# EAGLE design alarm_controller (EAGLE 7.6.0)

## Sheet 1 of 3
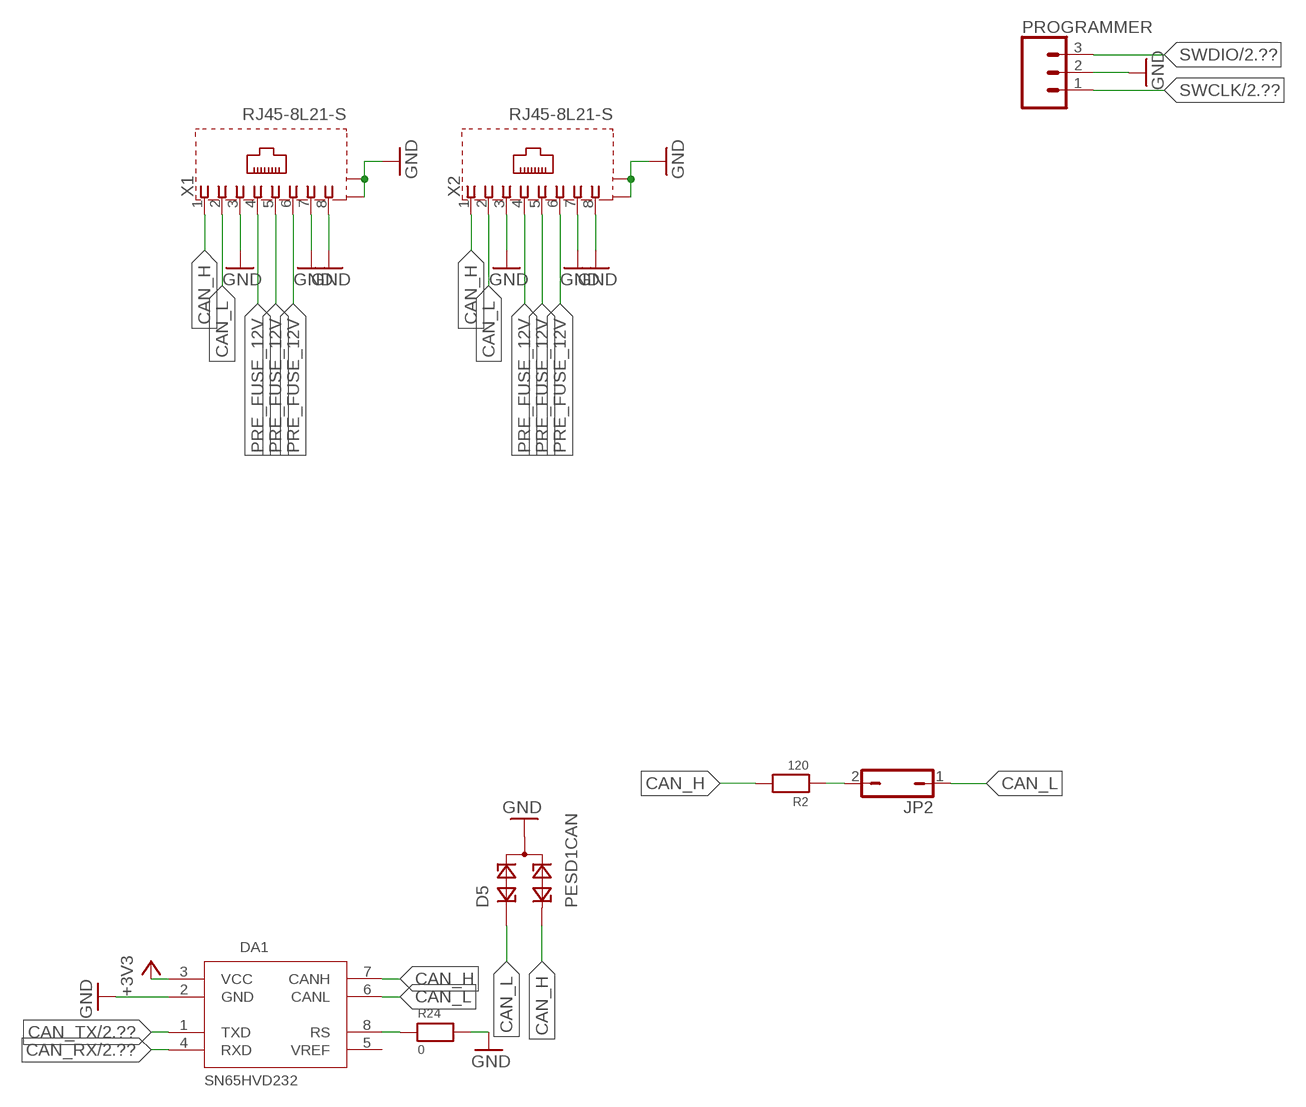
[diagram p0: schematic, sheet 1, part 1 of 2]
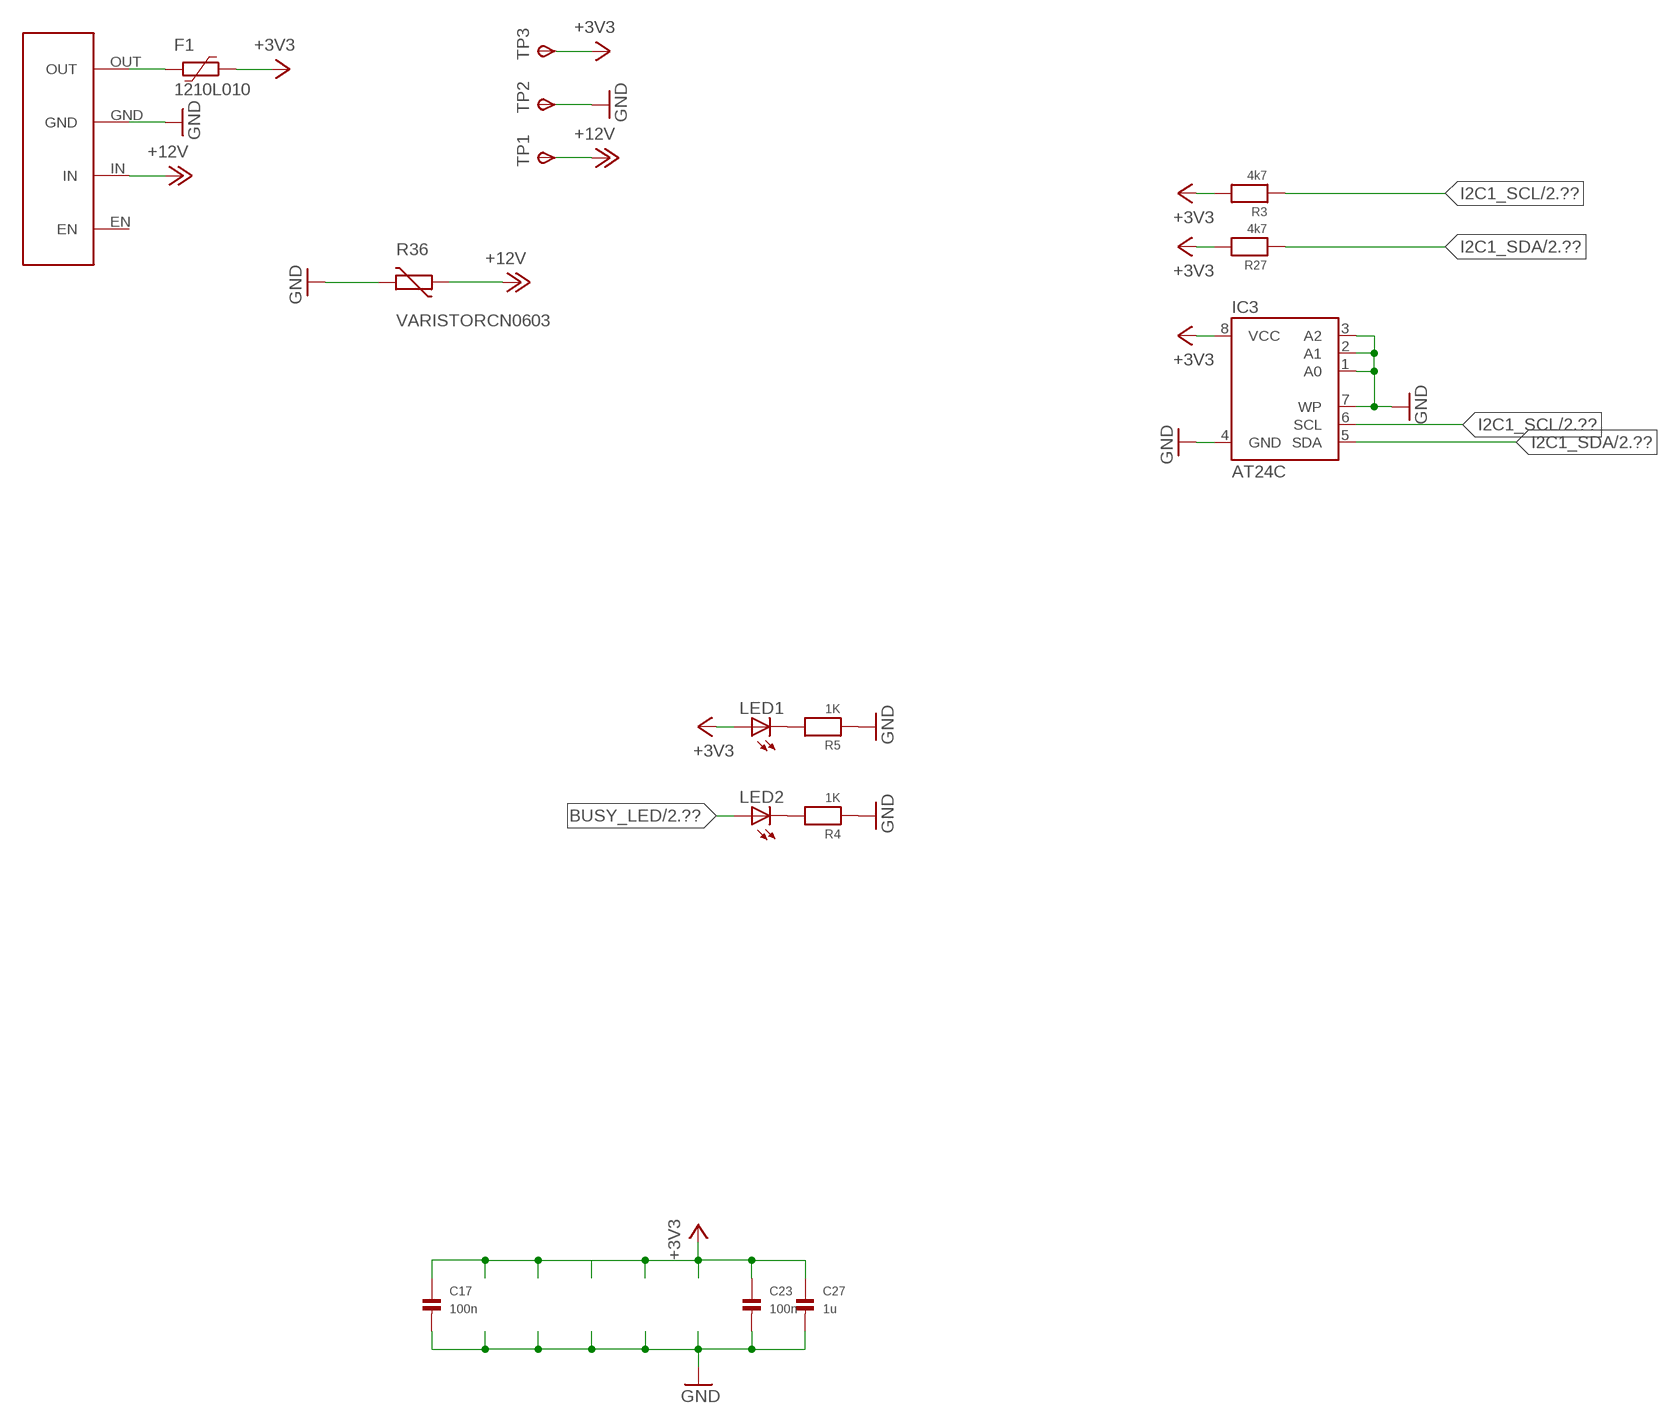
[diagram p1: schematic, sheet 1, part 2 of 2]

### Parts
C17  100n  CAP_CERAMIC0603  [0603]
C23  100n  CAP_CERAMIC0603  [0603]
C27  1u  CAP_CERAMIC0603  [0603]
D5  PESD1CAN  [SOT23]
DA1  SN65HVD232  [SO08]
F1  1210L010  [1210L]
IC3  AT24C  [SOIC8]
JP2  JP1Q  [JP1]
LED1  LEDCHIPLED_0805  [CHIPLED_0805]
LED2  LEDCHIPLED_0805  [CHIPLED_0805]
PROGRAMMER  CONN_03LOCK  [1X03_LOCK]
R2  120  RESISTOR0603  [0603]
R3  4k7  RESISTOR0603  [0603]
R4  1K  RESISTOR0603  [0603]
R5  1K  RESISTOR0603  [0603]
R24  0  RESISTOR0603  [0603]
R27  4k7  RESISTOR0603  [0603]
R36  VARISTORCN0603  [CT/CN0603]
TP1  TPSTP20R  [TP20R]
TP2  TPSTP20R  [TP20R]
TP3  TPSTP20R  [TP20R]
U$4  HW-613  [HW-613]
X1  RJ45-8L21-S  [RJ45-SHIELD1]
X2  RJ45-8L21-S  [RJ45-SHIELD1]

### Nets
+3V3: C17.1 C23.1 C27.1 DA1.3(VCC) F1.1 IC3.8(VCC) LED1.A R3.2 R27.2 TP3.TP(PP) ; also sheet 2,3
+12V: R36.1 TP1.TP(PP) U$4.IN ; also sheet 3
BUSY_LED: LED2.A ; also sheet 2
CAN_H: D5.2 DA1.7(CANH) R2.2 X1.1 X2.1
CAN_L: D5.1 DA1.6(CANL) JP2.1 X1.2 X2.2
CAN_RX: DA1.4(RXD) ; also sheet 2
CAN_TX: DA1.1(TXD) ; also sheet 2
GND: C17.2 C23.2 C27.2 D5.3 DA1.2(GND) IC3.1(A0) IC3.2(A1) IC3.3(A2) IC3.4(GND) IC3.7(WP) PROGRAMMER.2 R4.1 R5.1 R24.2 R36.2 TP2.TP(PP) U$4.GND X1.3 X1.7 X1.8 X1.S1(S) X1.S2(S) X2.3 X2.7 X2.8 X2.S1(S) X2.S2(S) ; also sheet 2,3
I2C1_SCL: IC3.6(SCL) R3.1 ; also sheet 2
I2C1_SDA: IC3.5(SDA) R27.1 ; also sheet 2
N$3: F1.2 U$4.OUT
N$6: LED1.C R5.2
N$8: LED2.C R4.2
N$12: JP2.2 R2.1
N$17: DA1.8(RS) R24.1
PRE_FUSE_12V: X1.4 X1.5 X1.6 X2.4 X2.5 X2.6 ; also sheet 3
SWCLK: PROGRAMMER.1 ; also sheet 2
SWDIO: PROGRAMMER.3 ; also sheet 2
Unconnected: DA1.5(VREF) U$4.EN

## Sheet 2 of 3
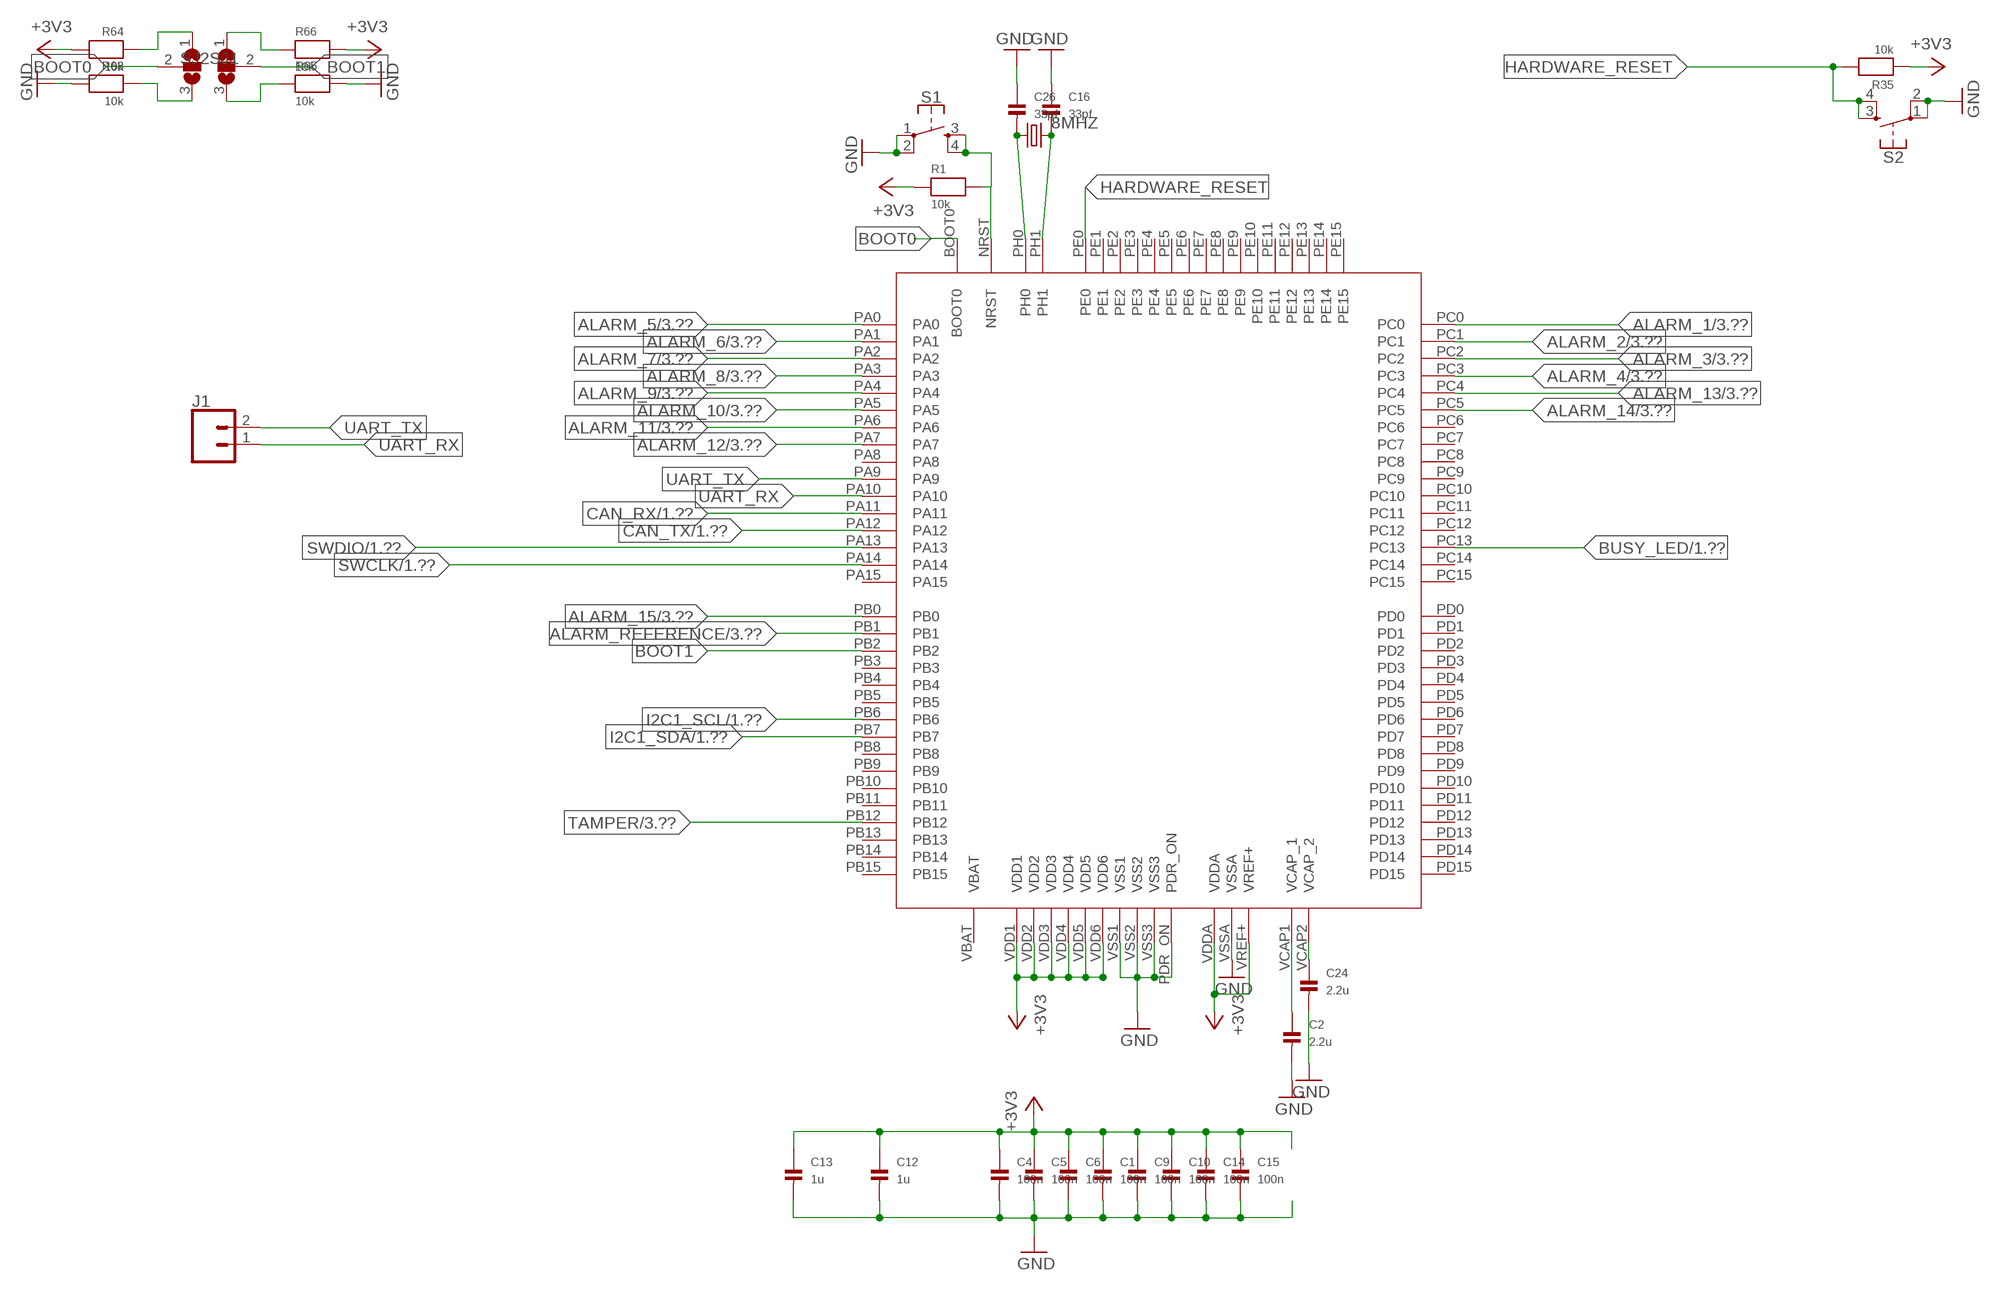
[diagram p2: schematic, sheet 2]

### Parts
8MHZ  CRYSTALHC49UP  [HC49UP]
C1  100n  CAP_CERAMIC0603  [0603]
C2  2.2u  CAP_CERAMIC0603  [0603]
C4  100n  CAP_CERAMIC0603  [0603]
C5  100n  CAP_CERAMIC0603  [0603]
C6  100n  CAP_CERAMIC0603  [0603]
C9  100n  CAP_CERAMIC0603  [0603]
C10  100n  CAP_CERAMIC0603  [0603]
C12  1u  CAP_CERAMIC0603  [0603]
C13  1u  CAP_CERAMIC0603  [0603]
C14  100n  CAP_CERAMIC0603  [0603]
C15  100n  CAP_CERAMIC0603  [0603]
C16  33pf  CAP_CERAMIC0603  [0603]
C24  2.2u  CAP_CERAMIC0603  [0603]
C26  33pf  CAP_CERAMIC0603  [0603]
J1  CONN_02  [1X02]
R1  10k  RESISTOR0603  [0603]
R35  10k  RESISTOR0603  [0603]
R63  10k  RESISTOR0603  [0603]
R64  10k  RESISTOR0603  [0603]
R65  10k  RESISTOR0603  [0603]
R66  10k  RESISTOR0603  [0603]
S1  MOMENTARY-SWITCH-SPST-2-SMD-4.6X2.8MM  [TACTILE_SWITCH_SMD_4.6X2.8MM]
S2  MOMENTARY-SWITCH-SPST-2-SMD-4.6X2.8MM  [TACTILE_SWITCH_SMD_4.6X2.8MM]
SJ1  SJ2W  [SJ_2]
SJ2  SJ2W  [SJ_2]
U$1  STM32F4V_100PIN_GENERIC  [LQFP100]

### Nets
+3V3: C1.1 C4.1 C5.1 C6.1 C9.1 C10.1 C12.1 C13.1 C14.1 C15.1 R1.1 R35.1 R64.2 R66.2 U$1.VDD1 U$1.VDD2 U$1.VDD3 U$1.VDD4 U$1.VDD5 U$1.VDD6 U$1.VDDA U$1.VREF+ ; also sheet 1,3
ALARM_1: U$1.PC0 ; also sheet 3
ALARM_2: U$1.PC1 ; also sheet 3
ALARM_3: U$1.PC2 ; also sheet 3
ALARM_4: U$1.PC3 ; also sheet 3
ALARM_5: U$1.PA0 ; also sheet 3
ALARM_6: U$1.PA1 ; also sheet 3
ALARM_7: U$1.PA2 ; also sheet 3
ALARM_8: U$1.PA3 ; also sheet 3
ALARM_9: U$1.PA4 ; also sheet 3
ALARM_10: U$1.PA5 ; also sheet 3
ALARM_11: U$1.PA6 ; also sheet 3
ALARM_12: U$1.PA7 ; also sheet 3
ALARM_13: U$1.PC4 ; also sheet 3
ALARM_14: U$1.PC5 ; also sheet 3
ALARM_15: U$1.PB0 ; also sheet 3
ALARM_REFERENCE: U$1.PB1 ; also sheet 3
BOOT0: SJ1.2 U$1.BOOT0
BOOT1: SJ2.2 U$1.PB2
BUSY_LED: U$1.PC13 ; also sheet 1
CAN_RX: U$1.PA11 ; also sheet 1
CAN_TX: U$1.PA12 ; also sheet 1
GND: C1.2 C2.2 C4.2 C5.2 C6.2 C9.2 C10.2 C12.2 C13.2 C14.2 C15.2 C16.1 C24.2 C26.1 R63.2 R65.2 S1.1 S1.2 S2.1 S2.2 U$1.PDR_ON U$1.VSS1 U$1.VSS2 U$1.VSS3 U$1.VSSA ; also sheet 1,3
HARDWARE_RESET: R35.2 S2.3 S2.4 U$1.PE0
I2C1_SCL: U$1.PB6 ; also sheet 1
I2C1_SDA: U$1.PB7 ; also sheet 1
N$1: 8MHZ.2 C16.2 U$1.PH1
N$2: 8MHZ.1 C26.2 U$1.PH0
N$4: C2.1 U$1.VCAP1(VCAP_1)
N$5: R66.1 SJ2.1
N$7: R1.2 S1.3 S1.4 U$1.NRST
N$9: C24.1 U$1.VCAP2(VCAP_2)
N$13: R64.1 SJ1.1
N$14: R65.1 SJ2.3
N$15: R63.1 SJ1.3
SWCLK: U$1.PA14 ; also sheet 1
SWDIO: U$1.PA13 ; also sheet 1
TAMPER: U$1.PB12 ; also sheet 3
UART_RX: J1.1 U$1.PA10
UART_TX: J1.2 U$1.PA9
Unconnected: U$1.PA8 U$1.PA15 U$1.PB3 U$1.PB4 U$1.PB5 U$1.PB8 U$1.PB9 U$1.PB10 U$1.PB11 U$1.PB13 U$1.PB14 U$1.PB15 U$1.PC6 U$1.PC7 U$1.PC8 U$1.PC9 U$1.PC10 U$1.PC11 U$1.PC12 U$1.PC14 U$1.PC15 U$1.PD0 U$1.PD1 U$1.PD2 U$1.PD3 U$1.PD4 U$1.PD5 U$1.PD6 U$1.PD7 U$1.PD8 U$1.PD9 U$1.PD10 U$1.PD11 U$1.PD12 U$1.PD13 U$1.PD14 U$1.PD15 U$1.PE1 U$1.PE2 U$1.PE3 U$1.PE4 U$1.PE5 U$1.PE6 U$1.PE7 U$1.PE8 U$1.PE9 U$1.PE10 U$1.PE11 U$1.PE12 U$1.PE13 U$1.PE14 U$1.PE15 U$1.VBAT

## Sheet 3 of 3
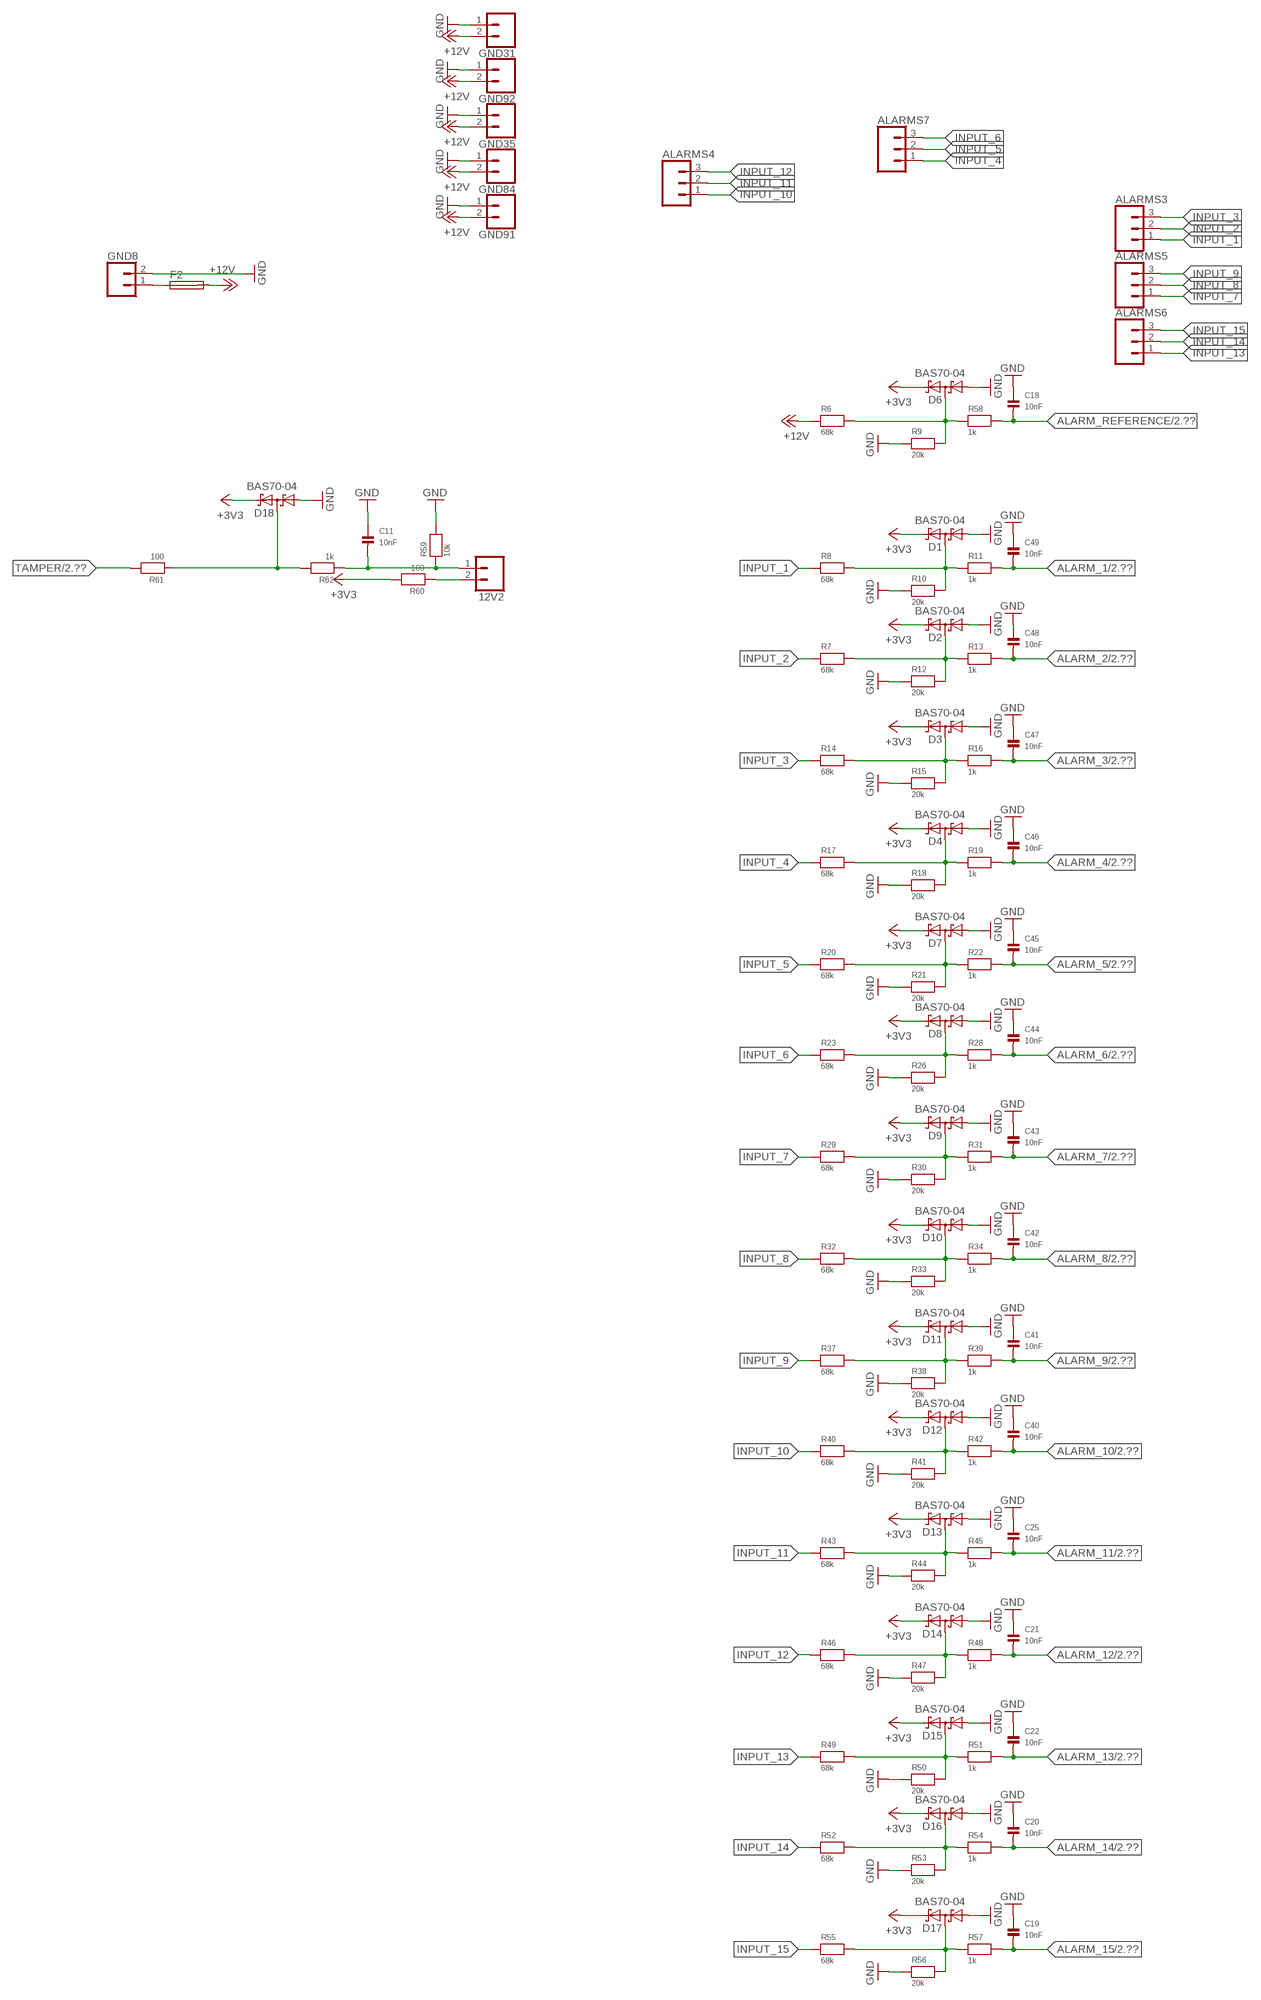
[diagram p3: schematic, sheet 3]

### Parts
12V2  CONN_023.5MM  [SCREWTERMINAL-3.5MM-2]
ALARMS3  CONN_03SCREW_LOCK  [SCREWTERMINAL-3.5MM-3_LOCK.007S]
ALARMS4  CONN_03SCREW_LOCK  [SCREWTERMINAL-3.5MM-3_LOCK.007S]
ALARMS5  CONN_03SCREW_LOCK  [SCREWTERMINAL-3.5MM-3_LOCK.007S]
ALARMS6  CONN_03SCREW_LOCK  [SCREWTERMINAL-3.5MM-3_LOCK.007S]
ALARMS7  CONN_03SCREW_LOCK  [SCREWTERMINAL-3.5MM-3_LOCK.007S]
C11  10nF  CAP_CERAMIC0603  [0603]
C18  10nF  CAP_CERAMIC0603  [0603]
C19  10nF  CAP_CERAMIC0603  [0603]
C20  10nF  CAP_CERAMIC0603  [0603]
C21  10nF  CAP_CERAMIC0603  [0603]
C22  10nF  CAP_CERAMIC0603  [0603]
C25  10nF  CAP_CERAMIC0603  [0603]
C40  10nF  CAP_CERAMIC0603  [0603]
C41  10nF  CAP_CERAMIC0603  [0603]
C42  10nF  CAP_CERAMIC0603  [0603]
C43  10nF  CAP_CERAMIC0603  [0603]
C44  10nF  CAP_CERAMIC0603  [0603]
C45  10nF  CAP_CERAMIC0603  [0603]
C46  10nF  CAP_CERAMIC0603  [0603]
C47  10nF  CAP_CERAMIC0603  [0603]
C48  10nF  CAP_CERAMIC0603  [0603]
C49  10nF  CAP_CERAMIC0603  [0603]
D1  BAS70-04  [SOT23]
D2  BAS70-04  [SOT23]
D3  BAS70-04  [SOT23]
D4  BAS70-04  [SOT23]
D6  BAS70-04  [SOT23]
D7  BAS70-04  [SOT23]
D8  BAS70-04  [SOT23]
D9  BAS70-04  [SOT23]
D10  BAS70-04  [SOT23]
D11  BAS70-04  [SOT23]
D12  BAS70-04  [SOT23]
D13  BAS70-04  [SOT23]
D14  BAS70-04  [SOT23]
D15  BAS70-04  [SOT23]
D16  BAS70-04  [SOT23]
D17  BAS70-04  [SOT23]
D18  BAS70-04  [SOT23]
F2  TE5  [TE5]
GND8  CONN_025MM  [SCREWTERMINAL-5MM-2]
GND31  CONN_023.5MM  [SCREWTERMINAL-3.5MM-2]
GND35  CONN_023.5MM  [SCREWTERMINAL-3.5MM-2]
GND84  CONN_023.5MM  [SCREWTERMINAL-3.5MM-2]
GND91  CONN_023.5MM  [SCREWTERMINAL-3.5MM-2]
GND92  CONN_023.5MM  [SCREWTERMINAL-3.5MM-2]
R6  68k  RESISTOR0603  [0603]
R7  68k  RESISTOR0603  [0603]
R8  68k  RESISTOR0603  [0603]
R9  20k  RESISTOR0603  [0603]
R10  20k  RESISTOR0603  [0603]
R11  1k  RESISTOR0603  [0603]
R12  20k  RESISTOR0603  [0603]
R13  1k  RESISTOR0603  [0603]
R14  68k  RESISTOR0603  [0603]
R15  20k  RESISTOR0603  [0603]
R16  1k  RESISTOR0603  [0603]
R17  68k  RESISTOR0603  [0603]
R18  20k  RESISTOR0603  [0603]
R19  1k  RESISTOR0603  [0603]
R20  68k  RESISTOR0603  [0603]
R21  20k  RESISTOR0603  [0603]
R22  1k  RESISTOR0603  [0603]
R23  68k  RESISTOR0603  [0603]
R26  20k  RESISTOR0603  [0603]
R28  1k  RESISTOR0603  [0603]
R29  68k  RESISTOR0603  [0603]
R30  20k  RESISTOR0603  [0603]
R31  1k  RESISTOR0603  [0603]
R32  68k  RESISTOR0603  [0603]
R33  20k  RESISTOR0603  [0603]
R34  1k  RESISTOR0603  [0603]
R37  68k  RESISTOR0603  [0603]
R38  20k  RESISTOR0603  [0603]
R39  1k  RESISTOR0603  [0603]
R40  68k  RESISTOR0603  [0603]
R41  20k  RESISTOR0603  [0603]
R42  1k  RESISTOR0603  [0603]
R43  68k  RESISTOR0603  [0603]
R44  20k  RESISTOR0603  [0603]
R45  1k  RESISTOR0603  [0603]
R46  68k  RESISTOR0603  [0603]
R47  20k  RESISTOR0603  [0603]
R48  1k  RESISTOR0603  [0603]
R49  68k  RESISTOR0603  [0603]
R50  20k  RESISTOR0603  [0603]
R51  1k  RESISTOR0603  [0603]
R52  68k  RESISTOR0603  [0603]
R53  20k  RESISTOR0603  [0603]
R54  1k  RESISTOR0603  [0603]
R55  68k  RESISTOR0603  [0603]
R56  20k  RESISTOR0603  [0603]
R57  1k  RESISTOR0603  [0603]
R58  1k  RESISTOR0603  [0603]
R59  10k  RESISTOR0603  [0603]
R60  100  RESISTOR0603  [0603]
R61  100  RESISTOR0603  [0603]
R62  1k  RESISTOR0603  [0603]

### Nets
12V_REFERENCE1: D2.3(C1A2) R7.2 R12.2 R13.1
12V_REFERENCE2: D3.3(C1A2) R14.2 R15.2 R16.1
12V_REFERENCE3: D4.3(C1A2) R17.2 R18.2 R19.1
12V_REFERENCE4: D7.3(C1A2) R20.2 R21.2 R22.1
12V_REFERENCE5: D8.3(C1A2) R23.2 R26.2 R28.1
12V_REFERENCE6: D9.3(C1A2) R29.2 R30.2 R31.1
12V_REFERENCE7: D10.3(C1A2) R32.2 R33.2 R34.1
12V_REFERENCE8: D11.3(C1A2) R37.2 R38.2 R39.1
12V_REFERENCE9: D12.3(C1A2) R40.2 R41.2 R42.1
12V_REFERENCE10: D13.3(C1A2) R43.2 R44.2 R45.1
12V_REFERENCE11: D14.3(C1A2) R46.2 R47.2 R48.1
12V_REFERENCE12: D15.3(C1A2) R49.2 R50.2 R51.1
12V_REFERENCE13: D16.3(C1A2) R52.2 R53.2 R54.1
12V_REFERENCE14: D17.3(C1A2) R55.2 R56.2 R57.1
+3V3: D1.2(C2) D2.2(C2) D3.2(C2) D4.2(C2) D6.2(C2) D7.2(C2) D8.2(C2) D9.2(C2) D10.2(C2) D11.2(C2) D12.2(C2) D13.2(C2) D14.2(C2) D15.2(C2) D16.2(C2) D17.2(C2) D18.2(C2) R60.2 ; also sheet 1,2
+12V: F2.2 GND31.2 GND35.2 GND84.2 GND91.2 GND92.2 R6.1 ; also sheet 1
A23: D6.3(C1A2) R6.2 R9.2 R58.1
ALARM_1: C49.2 R11.2 ; also sheet 2
ALARM_2: C48.2 R13.2 ; also sheet 2
ALARM_3: C47.2 R16.2 ; also sheet 2
ALARM_4: C46.2 R19.2 ; also sheet 2
ALARM_5: C45.2 R22.2 ; also sheet 2
ALARM_6: C44.2 R28.2 ; also sheet 2
ALARM_7: C43.2 R31.2 ; also sheet 2
ALARM_8: C42.2 R34.2 ; also sheet 2
ALARM_9: C41.2 R39.2 ; also sheet 2
ALARM_10: C40.2 R42.2 ; also sheet 2
ALARM_11: C25.2 R45.2 ; also sheet 2
ALARM_12: C21.2 R48.2 ; also sheet 2
ALARM_13: C22.2 R51.2 ; also sheet 2
ALARM_14: C20.2 R54.2 ; also sheet 2
ALARM_15: C19.2 R57.2 ; also sheet 2
ALARM_REFERENCE: C18.2 R58.2 ; also sheet 2
ASD: D1.3(C1A2) R8.2 R10.2 R11.1
ASDASD: D18.3(C1A2) R61.1 R62.2
GND: C11.1 C18.1 C19.1 C20.1 C21.1 C22.1 C25.1 C40.1 C41.1 C42.1 C43.1 C44.1 C45.1 C46.1 C47.1 C48.1 C49.1 D1.1(A1) D2.1(A1) D3.1(A1) D4.1(A1) D6.1(A1) D7.1(A1) D8.1(A1) D9.1(A1) D10.1(A1) D11.1(A1) D12.1(A1) D13.1(A1) D14.1(A1) D15.1(A1) D16.1(A1) D17.1(A1) D18.1(A1) GND8.2 GND31.1 GND35.1 GND84.1 GND91.1 GND92.1 R9.1 R10.1 R12.1 R15.1 R18.1 R21.1 R26.1 R30.1 R33.1 R38.1 R41.1 R44.1 R47.1 R50.1 R53.1 R56.1 R59.2 ; also sheet 1,2
INPUT_1: ALARMS3.1 R8.1
INPUT_2: ALARMS3.2 R7.1
INPUT_3: ALARMS3.3 R14.1
INPUT_4: ALARMS7.1 R17.1
INPUT_5: ALARMS7.2 R20.1
INPUT_6: ALARMS7.3 R23.1
INPUT_7: ALARMS5.1 R29.1
INPUT_8: ALARMS5.2 R32.1
INPUT_9: ALARMS5.3 R37.1
INPUT_10: ALARMS4.1 R40.1
INPUT_11: ALARMS4.2 R43.1
INPUT_12: ALARMS4.3 R46.1
INPUT_13: ALARMS6.1 R49.1
INPUT_14: ALARMS6.2 R52.1
INPUT_15: ALARMS6.3 R55.1
N$10: 12V2.2 R60.1
N$11: 12V2.1 C11.2 R59.1 R62.1
PRE_FUSE_12V: F2.1 GND8.1 ; also sheet 1
TAMPER: R61.2 ; also sheet 2

## Library data of the parts
8MHZ = crystal:CRYSTAL: CRYSTAL; OC_FARNELL: unknown; OC_NEWARK: unknown
12V2 GND31 GND35 GND84 GND91 GND92 = SparkFun-Connectors:CONN_02: Multi connection point. Often used as Generic Header-pin footprint for 0.1 inch spaced/style header connections On any of the 0.1 inch spaced packages, you can populate with these: Break Away Headers - Straight <https://www.sparkfun.com/products/116> (PRT-00116) Break Away Male Headers - Right Angle <https://www.sparkfun.com/products/553> (PRT-00553) Female Headers <https://www.sparkfun.com/products/115> (PRT-00115) Break Away Headers - Machine Pin <https://www.sparkfun.com/products/117> (PRT-00117) Break Away Female Headers - Swiss Machine Pin <https://www.sparkfun.com/products/743> (PRT-00743) For SCREWTERMINALS and SPRING TERMINALS visit here: Screw Terimnals on SparkFun.com <https://www.sparkfun.com/search/results?term=Screw+Terminals> (5mm/3.5mm/2.54mm spacing) This device is also useful as a general connection point to wire up your design to another part of your project. Our various solder wires solder well into these plated through hole pads. Hook-Up Wire - Assortment (Stranded, 22 AWG) <https://www.sparkfun.com/products/11375> (PRT-11375) Hook-Up Wire - Assortment (Solid Core, 22 AWG) <https://www.sparkfun.com/products/11367> (PRT-11367) View the entire wire category on our website here <https://www.sparkfun.com/categories/141> Special notes: Molex polarized connector foot print use with: PRT-08233 with associated crimp pins and housings. 2.54_SCREWTERM for use with PRT-10571. 3.5mm Screw Terminal footprints for PRT-08084 5mm Screw Terminal footprints for use with PRT-08432; PROD_ID: CONN-08399
ALARMS3-ALARMS7 = SparkFun-Connectors:CONN_03: Multi connection point. Often used as Generic Header-pin footprint for 0.1 inch spaced/style header connections On any of the 0.1 inch spaced packages, you can populate with these: Break Away Headers - Straight <https://www.sparkfun.com/products/116> (PRT-00116) Break Away Male Headers - Right Angle <https://www.sparkfun.com/products/553> (PRT-00553) Female Headers <https://www.sparkfun.com/products/115> (PRT-00115) Break Away Headers - Machine Pin <https://www.sparkfun.com/products/117> (PRT-00117) Break Away Female Headers - Swiss Machine Pin <https://www.sparkfun.com/products/743> (PRT-00743) Stackable Header - 3 Pin (Female, 0.1") <https://www.sparkfun.com/products/13875> (PRT-13875) For SCREWTERMINALS and SPRING TERMINALS visit here: Screw Terimnals on SparkFun.com <https://www.sparkfun.com/search/results?term=Screw+Terminals> (5mm/3.5mm/2.54mm spacing) This device is also useful as a general connection point to wire up your design to another part of your project. Our various solder wires solder well into these plated through hole pads. Hook-Up Wire - Assortment (Stranded, 22 AWG) <https://www.sparkfun.com/products/11375> (PRT-11375) Hook-Up Wire - Assortment (Solid Core, 22 AWG) <https://www.sparkfun.com/products/11367> (PRT-11367) View the entire wire category on our website here <https://www.sparkfun.com/categories/141> Special notes: Molex polarized connector foot print use with SKU : PRT-08232 with associated crimp pins and housings.; PROD_ID: CONN-08288; SF_ID: PRT-08235
C1 C2 C4-C6 C9-C27 C40-C49 = microbuilder:CAP_CERAMIC: Ceramic Capacitors 0402 - 0402 Surface Mount Capacitors 16pF 50V 5% [Digikey: 445-4899-2-ND] 18pF 50V 5% [Digikey: 490-1281-2-ND] 22pF 50V 5% [Digikey: 490-1283-2-ND] 68pF 50V 5% [Digikey: 490-1289-2-ND] 0.1uF 10V 10% [Digikey: 490-1318-2-ND] 1.0uF 6.3V 10% [Digikey: 490-1320-2-ND] 0603 - 0603 Surface Mount Capacitors 16 pF 50V 5% [Digikey: 445-5051-2-ND] 22 pF 50V [Digikey: PCC220ACVTR-ND] 33 pF 50V 5% [Digikey: 490-1415-1-ND] 56pF 50V 5% [Digikey: 490-1421-1-ND] 220pF 50V 5% [Digikey: 445-1285-1-ND] 680 pF 50V 2200 pF 50V 5% C0G [Digikey: 445-1297-1-ND] 5600 pF 100V 5% X7R [Digikey: 478-3711-1-ND] 0.1 µF 25V 10% [Digikey: PCC2277TR-ND] 0.22 µF 16V 10% X7R [Digikey: 445-1318-1-ND] 1.0 µF 25V 10% [Digikey: 445-5146-2-ND] 0603 - RF Specific 3pF 250V +/-0.1pF RF [Digikey: 712-1347-1-ND] 18 pF 250V 5% [Digikey: 478-3505-1-ND or 712-1322-1-ND] 56 pF 250V 5% C0G RF [Digikey: 490-4867-1-ND] 68 pF 250V RF [Digikey: 490-4868-1-ND] 0805 - 0805 Surface Mount Capacitors 220 pF 250V 2% RF Ceramic Capacitor [Digikey: 712-1398-1-ND] 1000 pF 50V 2% NP0 Ceramic Capacitor [Digikey: 478-3760-1-ND] 0.1 µF 25V 10% Ceramic Capacitor [Digikey: PCC1828TR-ND] 1.0 µF 16V 10% Ceramic Capacitor[Digikey: 490-1691-2-ND] 10.0 µF 10V 10% Ceramic Capacitor[Digikey: 709-1228-1-ND] 10.0 uF 16V 10% Ceramic Capacitor [Digikey: 478-5165-2-ND] 47 uF 6.3V 20% Ceramic Capacitor [Digikey: 587-1779-1-ND or 399-5506-1-ND] 1206 - 1206 Surface Mount Capacitors 47uF 10V 20% Ceramic Capacitor [Digikey: 490-5528-1-ND or 399-5508-1-ND or 445-6010-1-ND] 100uF 6.3V -20%, +80% Y5V Ceramic Capacitor (Digikey: 490-4512-1-ND, Mouser: 81-GRM31CF50J107ZE1L)
D1-D4 D6-D18 = diode:BAS70-04: Silicon Schottky Diodes General-purpose diode for high-speed switching
D5 = diode:PESD1CAN: CAN bus ESD protection diode Source: http://www.nxp.com/documents/data_sheet/PESD1CAN.pdf
DA1 = transceiver:SN65HVD232: CAN TRANSCEIVER
F1 = polyfuse-smd_10:?: Polyfuse Resettable PTC Source: http://www.littelfuse.com/products/resettable-ptcs.aspx; MF: Littelfuse; MPN: 1210L010; OC_FARNELL: 1822206; OC_NEWARK: 18M4781
F2 = fuse:TE5: FUSE Wickmann; OC_FARNELL: unknown; OC_NEWARK: unknown
GND8 = SparkFun-Connectors:CONN_02: Multi connection point. Often used as Generic Header-pin footprint for 0.1 inch spaced/style header connections On any of the 0.1 inch spaced packages, you can populate with these: Break Away Headers - Straight <https://www.sparkfun.com/products/116> (PRT-00116) Break Away Male Headers - Right Angle <https://www.sparkfun.com/products/553> (PRT-00553) Female Headers <https://www.sparkfun.com/products/115> (PRT-00115) Break Away Headers - Machine Pin <https://www.sparkfun.com/products/117> (PRT-00117) Break Away Female Headers - Swiss Machine Pin <https://www.sparkfun.com/products/743> (PRT-00743) For SCREWTERMINALS and SPRING TERMINALS visit here: Screw Terimnals on SparkFun.com <https://www.sparkfun.com/search/results?term=Screw+Terminals> (5mm/3.5mm/2.54mm spacing) This device is also useful as a general connection point to wire up your design to another part of your project. Our various solder wires solder well into these plated through hole pads. Hook-Up Wire - Assortment (Stranded, 22 AWG) <https://www.sparkfun.com/products/11375> (PRT-11375) Hook-Up Wire - Assortment (Solid Core, 22 AWG) <https://www.sparkfun.com/products/11367> (PRT-11367) View the entire wire category on our website here <https://www.sparkfun.com/categories/141> Special notes: Molex polarized connector foot print use with: PRT-08233 with associated crimp pins and housings. 2.54_SCREWTERM for use with PRT-10571. 3.5mm Screw Terminal footprints for PRT-08084 5mm Screw Terminal footprints for use with PRT-08432; SF_SKU: PRT-08432
IC3 = EEPROM:AT24C*: 2-wire serial EEPROM
J1 = SparkFun-Connectors:CONN_02: Multi connection point. Often used as Generic Header-pin footprint for 0.1 inch spaced/style header connections On any of the 0.1 inch spaced packages, you can populate with these: Break Away Headers - Straight <https://www.sparkfun.com/products/116> (PRT-00116) Break Away Male Headers - Right Angle <https://www.sparkfun.com/products/553> (PRT-00553) Female Headers <https://www.sparkfun.com/products/115> (PRT-00115) Break Away Headers - Machine Pin <https://www.sparkfun.com/products/117> (PRT-00117) Break Away Female Headers - Swiss Machine Pin <https://www.sparkfun.com/products/743> (PRT-00743) For SCREWTERMINALS and SPRING TERMINALS visit here: Screw Terimnals on SparkFun.com <https://www.sparkfun.com/search/results?term=Screw+Terminals> (5mm/3.5mm/2.54mm spacing) This device is also useful as a general connection point to wire up your design to another part of your project. Our various solder wires solder well into these plated through hole pads. Hook-Up Wire - Assortment (Stranded, 22 AWG) <https://www.sparkfun.com/products/11375> (PRT-11375) Hook-Up Wire - Assortment (Solid Core, 22 AWG) <https://www.sparkfun.com/products/11367> (PRT-11367) View the entire wire category on our website here <https://www.sparkfun.com/categories/141> Special notes: Molex polarized connector foot print use with: PRT-08233 with associated crimp pins and housings. 2.54_SCREWTERM for use with PRT-10571. 3.5mm Screw Terminal footprints for PRT-08084 5mm Screw Terminal footprints for use with PRT-08432
JP2 = jumper:JP1Q: JUMPER
LED1 LED2 = led:LED: LED OSRAM: - CHIPLED LG R971, LG N971, LY N971, LG Q971, LY Q971, LO R971, LY R971 LH N974, LH R974 LS Q976, LO Q976, LY Q976 LO Q996 - Hyper CHIPLED LW Q18S LB Q993, LB Q99A, LB R99A - SideLED LS A670, LO A670, LY A670, LG A670, LP A670 LB A673, LV A673, LT A673, LW A673 LH A674 LY A675 LS A676, LA A676, LO A676, LY A676, LW A676 LS A679, LY A679, LG A679 - Hyper Micro SIDELED® LS Y876, LA Y876, LO Y876, LY Y876 LT Y87S - SmartLED LW L88C, LW L88S LB L89C, LB L89S, LG L890 LS L89K, LO L89K, LY L89K LS L896, LA L896, LO L896, LY L896 - TOPLED LS T670, LO T670, LY T670, LG T670, LP T670 LSG T670, LSP T670, LSY T670, LOP T670, LYG T670 LG T671, LOG T671, LSG T671 LB T673, LV T673, LT T673, LW T673 LH T674 LS T676, LA T676, LO T676, LY T676, LB T676, LH T676, LSB T676, LW T676 LB T67C, LV T67C, LT T67C, LS T67K, LO T67K, LY T67K, LW E67C LS E67B, LA E67B, LO E67B, LY E67B, LB E67C, LV E67C, LT E67C LW T67C LS T679, LY T679, LG T679 LS T770, LO T770, LY T770, LG T770, LP T770 LB T773, LV T773, LT T773, LW T773 LH T774 LS E675, LA E675, LY E675, LS T675 LS T776, LA T776, LO T776, LY T776, LB T776 LHGB T686 LT T68C, LB T68C - Hyper Mini TOPLED® LB M676 - Mini TOPLED Santana® LG M470 LS M47K, LO M47K, LY M47K Source: http://www.osram.convergy.de LUXEON: - LUMILED® LXK2-PW12-R00, LXK2-PW12-S00, LXK2-PW14-U00, LXK2-PW14-V00 LXK2-PM12-R00, LXK2-PM12-S00, LXK2-PM14-U00 LXK2-PE12-Q00, LXK2-PE12-R00, LXK2-PE12-S00, LXK2-PE14-T00, LXK2-PE14-U00 LXK2-PB12-K00, LXK2-PB12-L00, LXK2-PB12-M00, LXK2-PB14-N00, LXK2-PB14-P00, LXK2-PB14-Q00 LXK2-PR12-L00, LXK2-PR12-M00, LXK2-PR14-Q00, LXK2-PR14-R00 LXK2-PD12-Q00, LXK2-PD12-R00, LXK2-PD12-S00 LXK2-PH12-R00, LXK2-PH12-S00 LXK2-PL12-P00, LXK2-PL12-Q00, LXK2-PL12-R00 Source: www.luxeon.com KINGBRIGHT: KA-3528ASYC Source: www.kingbright.com
PROGRAMMER = SparkFun-Connectors:CONN_03: Multi connection point. Often used as Generic Header-pin footprint for 0.1 inch spaced/style header connections On any of the 0.1 inch spaced packages, you can populate with these: Break Away Headers - Straight <https://www.sparkfun.com/products/116> (PRT-00116) Break Away Male Headers - Right Angle <https://www.sparkfun.com/products/553> (PRT-00553) Female Headers <https://www.sparkfun.com/products/115> (PRT-00115) Break Away Headers - Machine Pin <https://www.sparkfun.com/products/117> (PRT-00117) Break Away Female Headers - Swiss Machine Pin <https://www.sparkfun.com/products/743> (PRT-00743) Stackable Header - 3 Pin (Female, 0.1") <https://www.sparkfun.com/products/13875> (PRT-13875) For SCREWTERMINALS and SPRING TERMINALS visit here: Screw Terimnals on SparkFun.com <https://www.sparkfun.com/search/results?term=Screw+Terminals> (5mm/3.5mm/2.54mm spacing) This device is also useful as a general connection point to wire up your design to another part of your project. Our various solder wires solder well into these plated through hole pads. Hook-Up Wire - Assortment (Stranded, 22 AWG) <https://www.sparkfun.com/products/11375> (PRT-11375) Hook-Up Wire - Assortment (Solid Core, 22 AWG) <https://www.sparkfun.com/products/11367> (PRT-11367) View the entire wire category on our website here <https://www.sparkfun.com/categories/141> Special notes: Molex polarized connector foot print use with SKU : PRT-08232 with associated crimp pins and housings.
R1-R24 R26-R35 R37-R66 = microbuilder:RESISTOR: Resistors 0402 - 0402 Surface Mount Package 22 Ohm 1% 1/16W [Digikey: 311-22.0LRTR-ND] 33 Ohm 5% 1/16W 1.0K 5% 1/16W 1.5K 5% 1/16W 2.0K 1% 1/16W 10.0K 1% 1/16W [Digikey: 311-10.0KLRTR-ND] 10.0K 5% 1/16W [Digikey: RMCF0402JT10K0TR-ND] 12.1K 1% 1/16W [Digikey: 311-22.0LRTR-ND] 100.0K 5% 1/16W 0603 - 0603 Surface Mount Package 0 Ohm 1/10 Watt 1% Resistor 15 Ohm 1/10 Watt 1% Resistor 33 Ohm 1/10 Watt 1% Resistor 49.9 Ohm 1/10 Watt 1% Resistor 100 Ohm 1/10 Watt 1% Resistor 150 Ohm 1/10 Watt 1% Resistor 240 Ohm 1/10 Watt 1% Resistor 390 Ohm 1/10 Watt 1% Resistor 560 Ohm 1/10 Watt 1% Resistor 680 Ohm 1/10 Watt 1% Resistor 750 Ohm 1/10 Watt 1% Resistor 1.0K Ohm 1/10 Watt 1% Resistor 1.5K Ohm 1/10 Watt 1% Resistor 2.0K Ohm 1/10 Watt 1% Resistor 2.2K Ohm 1/10 Watt 1% Resistor 3.3K Ohm 1/10 Watt 1% Resistor 4.7K Ohm 1/10 Watt 1% Resistor 10.0K Ohm 1/10 Watt 1% Resistor 12.0K Ohm 1/10 Watt 1% Resistor 12.1K Ohm 1/10 Watt 1% Resistor 20.0K Ohm 1/10 Watt 1% Resistor 33.0K Ohm 1/10 Watt 1% Resistor 100.0K Ohm 1/10 Watt 1% Resistor 0805 - 0805 Surface Mount Package 0 Ohm 1/8 Watt 1% Resistor 33 Ohm 1/8 Watt 1% Resistor 100 Ohm 1/8 Watt 1% Resistor 150 Ohm 1/8 Watt 1% Resistor 200 Ohm 1/8 Watt 1% Resistor 240 Ohm 1/8 Watt 1% Resistor 330 Ohm 1/8 Watt 1% Resistor 390 Ohm 1/8 Watt 1% Resistor 470 Ohm 1/8 Watt 1% Resistor 1.0K Ohm 1/8 Watt 1% Resistor 1.5K Ohm 1/8 Watt 1% Resistor 2.0K Ohm 1/8 Watt 1% Resistor 4.7K Ohm 1/8 Watt 1% Resistor 5.1K Ohm 1/8 Watt 1% Resistor 5.6K Ohm 1/8 Watt 1% Resistor 10.0K Ohm 1/8 Watt 1% Resistor 22.0K Ohm 1/8 Watt 1% Resistor 33.0K Ohm 1/8 Watt 1% Resistor 100K Ohm 1/8 Watt 1% Resistor 1206 - 1206 Surface Mount Package 2012 - 2010 Surface Mount Package 0.11 Ohm 1/2 Watt 1% Resistor - Digikey: RHM.11UCT-ND
R36 = varistor:VARISTOR: VARISTOR
S1 S2 = SparkFun-Switches:MOMENTARY-SWITCH-SPST-2: Momentary Switch (Pushbutton) - SPST - Two Circuits Normally-open (NO) SPST momentary switches (buttons, pushbuttons). Schematic symbol includes two switch circuits. Variants SMD-4.6MMX2.8MM - 4.60mm x 2.80mm Tactile Momentary Button Switch - Used on SparkFun SAMD21 Mini Breakout <https://www.sparkfun.com/products/13664> SMD-5.2MM - Mini Pushbutton Switch - SMD <https://www.sparkfun.com/products/8720> - Used on Arduino Pro Mini <https://www.sparkfun.com/products/11114>; PROD_ID: SWCH-13065
SJ1 SJ2 = jumper:SJ2W: SMD solder JUMPER
TP1-TP3 = testpad:TPS: TEST PIN
U$1 = stm32f4:STM32F4V_100PIN_GENERIC
U$4 = components:HW-613
X1 X2 = con-tycoelectronics:RJ45*2: RJ45 Low Profile Shield Type 2 For all RJ45 L, LC, LCT and X Series Models Source: www.tycoelectronics.com .. ENG_DS_1654001_1099_RJ_L_0507.pdf; OC_FARNELL: unknown; OC_NEWARK: unknown

## Board
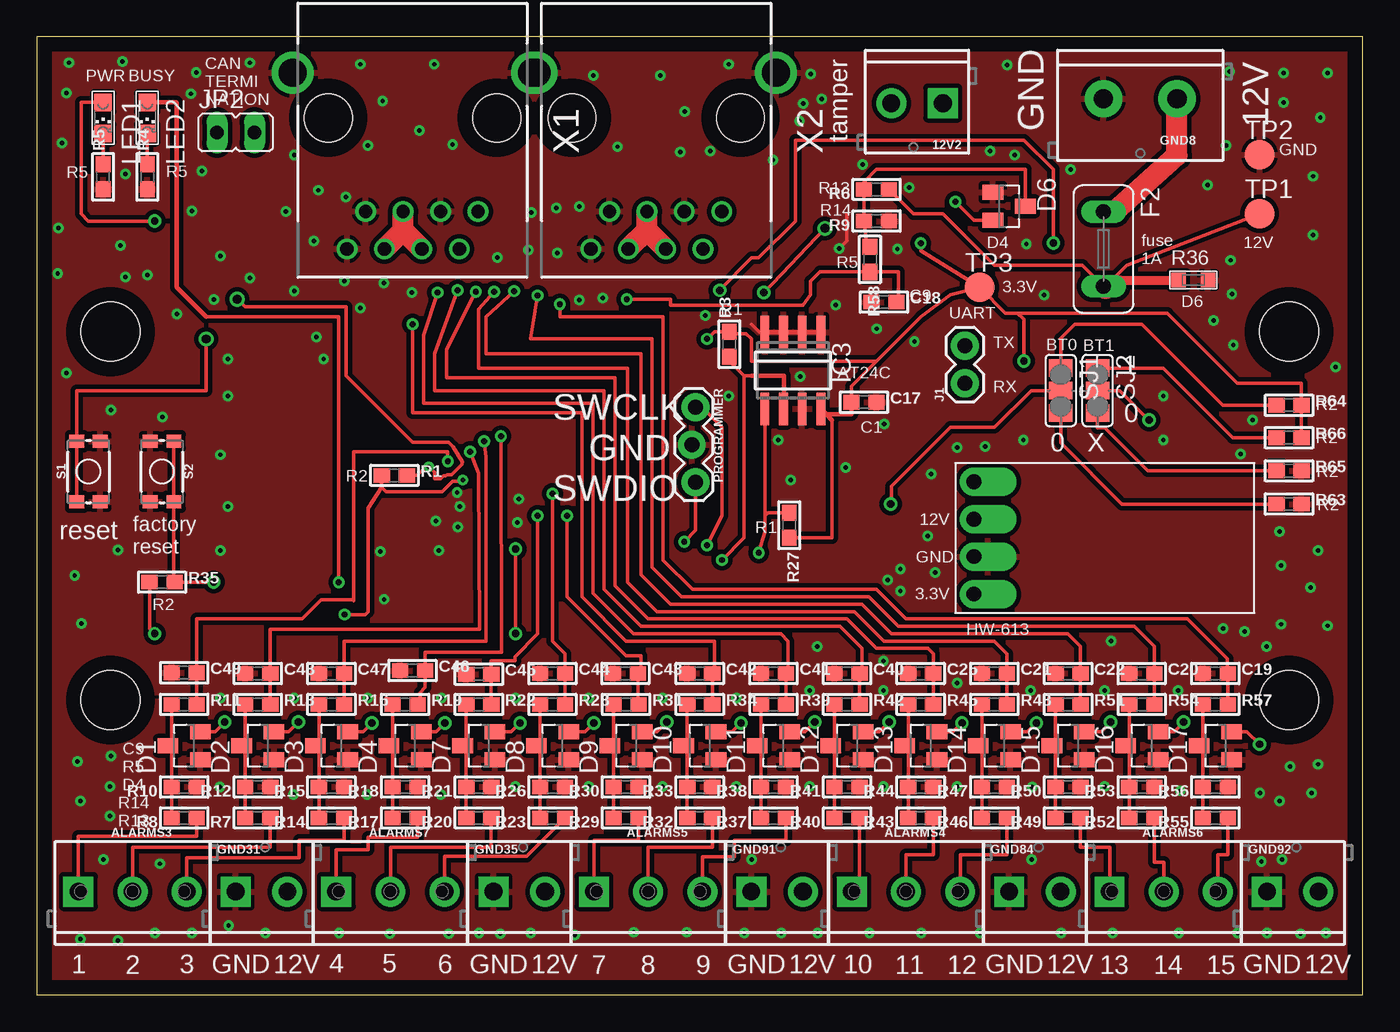
[diagram p4: board, top side]
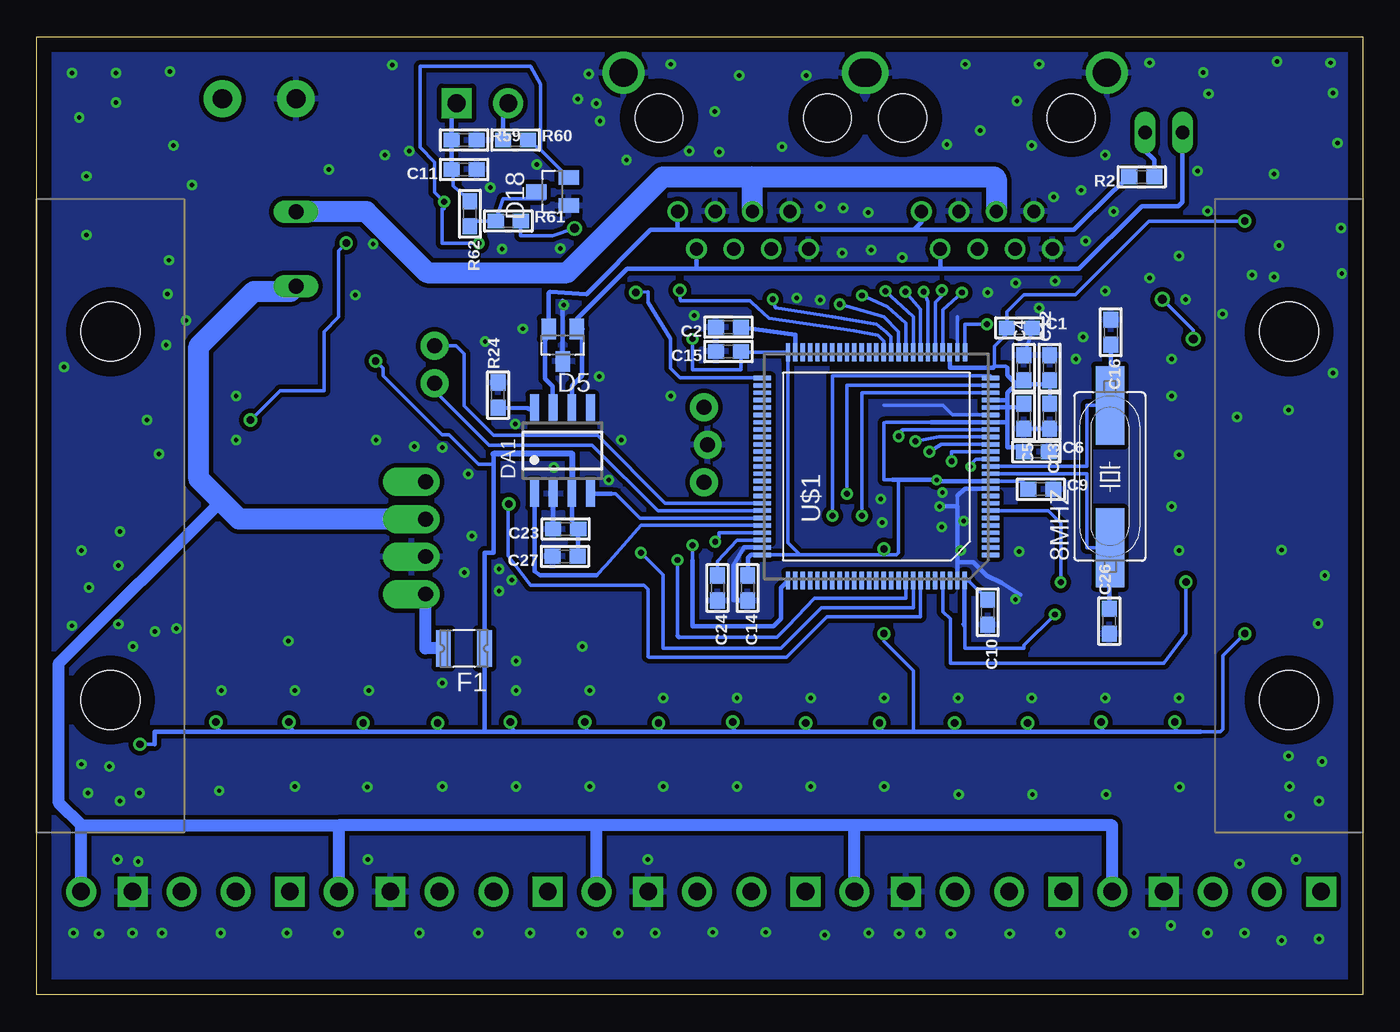
[diagram p5: board, bottom side, seen from below]

Size 90 x 65 mm. Coordinates in mm from the lower left corner, seen from the top.
Outline: 0,0 90,0 90,65 0,65 0,0
Copper layers (1*16): Top 0.035mm / dielectric 1.5mm / Bottom 0.035mm
Design rules "default *": minimum track width 10mil, minimum drill 0.3mm, track to track 6mil, track to pad 6mil, pad to pad 6mil, via to via 6mil, smd to smd 6mil, copper to edge 40mil, drill to drill 8mil, minimum pad ring 10mil, minimum via ring 8mil, stop-mask expansion 4mil, vias tented up to drill 0mil, thermal gap 10mil

### Footprints (pad centres in the part's own frame; a part is rotated, then mirrored left to right if it is on the bottom)
HC49UP = smd 5.334 x 1.93: 1 -4.826,0; 2 4.826,0
SCREWTERMINAL-3.5MM-2 = drill 1.2 pad 2.032 square: 1 0,0 | drill 1.2 pad 2.032: 2 3.5,0
SCREWTERMINAL-3.5MM-3_LOCK.007S = drill 1.2 pad 2.032 square: 1 -0.178,0 | drill 1.2 pad 2.032: 2 3.5,0; 3 7.178,0
0603 = smd 1.1 x 1: 1 -0.85,0; 2 0.85,0
SOT23 = smd 1 x 1.4: 1 -0.95,-1.1; 2 0.95,-1.1; 3 0,1.1
SO08 = smd 0.6 x 1.8: 1 -1.905,-2.917; 2 -0.635,-2.917; 3 0.635,-2.917; 4 1.905,-2.917; 5 1.905,2.917; 6 0.635,2.917; 7 -0.635,2.917; 8 -1.905,2.917
1210L = smd 1 x 2.5: 1 -1.4,0; 2 1.4,0
TE5 = drill 1.016 long: 1 -2.54,0; 2 2.54,0
SCREWTERMINAL-5MM-2 = drill 1.3 pad 2.54: 1 0,0; 2 5,0
SOIC8 = smd 0.6 x 2.2: 1 -1.905,-2.6; 2 -0.635,-2.6; 3 0.635,-2.6; 4 1.905,-2.6; 5 1.905,2.6; 6 0.635,2.6; 7 -0.635,2.6; 8 -1.905,2.6
1X02 = drill 1.016 pad 1.88: 1 0,0; 2 2.54,0
JP1 = drill 0.914 long: 1 0,-1.27; 2 0,1.27
CHIPLED_0805 = smd 1.2 x 1.2: A 0,-1.05; C 0,1.05
1X03_LOCK = drill 1.016 pad 1.88: 1 0,0.127; 2 2.54,-0.127; 3 5.08,0.127
CT/CN0603 = smd 1 x 1: 1 -1,0; 2 1,0
TACTILE_SWITCH_SMD_4.6X2.8MM = smd 0.9 x 1: 1 -2.05,-0.8; 2 2.05,-0.8; 3 2.05,0.8; 4 -2.05,0.8
SJ_2 = smd 1.168 x 1.6: 1 -1.524,0; 2 0,0; 3 1.524,0
TP20R = smd 2 x 2: TP 0,0
LQFP100 = smd 1.2 x 0.3: BOOT0 -7.75,-3; PA3 7.75,-6.016; PA4 7.75,-4.5; PA5 7.75,-4; PA6 7.75,-3.5; PA7 7.75,-3; PA14 -7.75,6; PA15 -7.75,5.5; PB0 7.75,-1.5; PB1 7.75,-1; PB2 7.75,-0.5; PB3 -7.75,-0.5; PB4 -7.75,-1; PB5 -7.75,-1.5; PB6 -7.75,-2; PB7 -7.75,-2.5; PB8 -7.75,-3.5; PB9 -7.75,-4; PB10 7.75,4.5; PB11 7.75,5; PC4 7.75,-2.5; PC5 7.75,-2; PC10 -7.75,5; PC11 -7.75,4.5; PC12 -7.75,4; PD0 -7.75,3.5; PD1 -7.75,3; PD2 -7.75,2.5; PD3 -7.75,2; PD4 -7.75,1.5; PD5 -7.75,1; PD6 -7.75,0.5; PD7 -7.75,0; PDR_ON -7.75,-5.5; PE0 -7.75,-4.5; PE1 -7.75,-5; PE7 7.75,0; PE8 7.75,0.5; PE9 7.75,1; PE10 7.75,1.5; PE11 7.75,2; PE12 7.75,2.5; PE13 7.75,3; PE14 7.75,3.5; PE15 7.75,4; VCAP1 7.75,5.5; VDD3 7.75,-4.984; VDD4 7.75,6; VDD6 -7.75,-6; VSS2 7.75,-5.5 | smd 0.3 x 1.2: NRST 0.5,-7.75; PA0 5,-7.75; PA1 5.5,-7.75; PA2 6,-7.75; PA8 -2,7.75; PA9 -2.5,7.75; PA10 -3,7.75; PA11 -3.5,7.75; PA12 -4,7.75; PA13 -4.5,7.75; PB12 6,7.75; PB13 5.5,7.75; PB14 5,7.75; PB15 4.5,7.75; PC0 1,-7.75; PC1 1.5,-7.75; PC2 2,-7.75; PC3 2.5,-7.75; PC6 0,7.75; PC7 -0.5,7.75; PC8 -1,7.75; PC9 -1.5,7.75; PC13 -3,-7.75; PC14 -2.5,-7.75; PC15 -2,-7.75; PD8 4,7.75; PD9 3.5,7.75; PD10 3,7.75; PD11 2.5,7.75; PD12 2,7.75; PD13 1.5,7.75; PD14 1,7.75; PD15 0.5,7.75; PE2 -6,-7.75; PE3 -5.5,-7.75; PE4 -5,-7.75; PE5 -4.5,-7.75; PE6 -4,-7.75; PH0 -0.5,-7.75; PH1 0,-7.75; VBAT -3.5,-7.75; VCAP2 -5,7.75; VDD1 -1,-7.75; VDD2 3,-7.75; VDD5 -6,7.75; VDDA 4.5,-7.75; VREF+ 4,-7.75; VSS1 -1.5,-7.75; VSS3 -5.5,7.75; VSSA 3.5,-7.75
HW-613 = drill 1 pad 1.93 offset: EN -8.89,3.81; GND -8.89,-1.27; IN -8.89,1.27; OUT -8.89,-3.81
C45-DIN-MOUNT-2-HOLE = hole 4: 0,12.5; 0,-12.5
RJ45-SHIELD1 = drill 0.9 pad 1.4: 1 -4.445,6.35; 2 -3.175,8.89; 3 -1.905,6.35; 4 -0.635,8.89; 5 0.635,6.35; 6 1.905,8.89; 7 3.175,6.35; 8 4.445,8.89 | drill 1.9 pad 2.5: S1 -8.128,-3.048; S2 8.128,-3.048 | hole 3.251: -5.715,0; 5.715,0

### Placement (x,y rotation side)
8MHZ  17.15,35.16 90 bottom
12V2  61.5,60.5 180 top
ALARMS3  3,7 0 top
ALARMS4  55.5,7 0 top
ALARMS5  38,7 0 top
ALARMS6  73,7 0 top
ALARMS7  20.5,7 0 top
C1  23.3,45.25 0 bottom
C2  43.05,45.3 180 bottom
C4  23,42.55 90 bottom
C5  23,39.25 270 bottom
C6  22.15,36.85 0 bottom
C9  21.85,34.3 0 bottom
C10  25.45,25.95 270 bottom
C11  61,56 180 bottom
C12  21.25,42.55 90 bottom
C13  21.25,39.25 270 bottom
C14  41.75,27.6 270 bottom
C15  43.05,43.65 180 bottom
C16  17.1,44.95 270 bottom
C17  56.15,40.2 0 top
C18  57.5,47 0 top
C19  80,21.8 0 top
C20  75,21.8 0 top
C21  65,21.8 0 top
C22  70,21.8 0 top
C23  54.1,31.6 180 bottom
C24  43.8,27.6 270 bottom
C25  60,21.8 0 top
C26  17.2,25.35 90 bottom
C27  54.15,29.75 180 bottom
C40  55,21.8 0 top
C41  50,21.8 0 top
C42  45,21.8 0 top
C43  39.95,21.8 0 top
C44  35,21.8 0 top
C45  30,21.75 0 top
C46  25.5,22 0 top
C47  20,21.8 0 top
C48  15,21.8 0 top
C49  10,21.85 0 top
D1  10,16.9 90 top
D2  15,16.9 90 top
D3  20,16.9 90 top
D4  25,16.9 90 top
D5  54.3,44.08 180 bottom
D6  66,53.5 270 top
D7  30,16.9 90 top
D8  35,16.9 90 top
D9  40,16.9 90 top
D10  45,16.9 90 top
D11  50,16.9 90 top
D12  55,16.9 90 top
D13  60,16.9 90 top
D14  65,16.9 90 top
D15  70,16.9 90 top
D16  75,16.9 90 top
D17  80,16.9 90 top
D18  55,54.5 90 bottom
DA1  54.32,36.92 0 bottom
F1  61,23.5 180 bottom
F2  72.4,50.6 270 top
GND8  77.4,60.8 180 top
GND31  13.5,7 0 top
GND35  31,7 0 top
GND84  66,7 0 top
GND91  48.5,7 0 top
GND92  83.5,7 0 top
IC3  51.32,42.36 180 top
J1  63,41.5 90 top
JP2  13.5,58.5 270 top
LED1  4.5,59.5 180 top
LED2  7.5,59.5 180 top
PROGRAMMER  44.59,39.86 270 top
R1  24.27,35.24 0 top
R2  15,55.5 180 bottom
R3  47.01,44.14 90 top
R4  7.5,55.5 90 top
R5  4.5,55.5 90 top
R6  57,54.65 180 top
R7  15,12 180 top
R8  10,12 180 top
R9  57,52.5 180 top
R10  10,14.1 180 top
R11  10,19.7 0 top
R12  15,14.1 180 top
R13  15,19.7 0 top
R14  20,12 180 top
R15  20,14.1 180 top
R16  20,19.7 0 top
R17  25,12 180 top
R18  25,14.1 180 top
R19  25,19.7 0 top
R20  30,12 180 top
R21  30,14.1 180 top
R22  30,19.7 0 top
R23  35,12 180 top
R24  58.69,40.69 90 bottom
R26  35,14.1 180 top
R27  51.07,31.86 270 top
R28  35,19.7 0 top
R29  40,12 180 top
R30  40,14.1 180 top
R31  40,19.7 0 top
R32  45,12 180 top
R33  45,14.1 180 top
R34  45,19.7 0 top
R35  8.5,28 0 top
R36  78.5,48.5 0 top
R37  50,12 180 top
R38  50,14.1 180 top
R39  50,19.7 0 top
R40  55,12 180 top
R41  55,14.1 180 top
R42  55,19.7 0 top
R43  60,12 180 top
R44  60,14.1 180 top
R45  60,19.7 0 top
R46  65,12 180 top
R47  65,14.1 180 top
R48  65,19.7 0 top
R49  70,12 180 top
R50  70,14.1 180 top
R51  70,19.7 0 top
R52  75,12 180 top
R53  75,14.1 180 top
R54  75,19.7 0 top
R55  80,12 180 top
R56  80,14.1 180 top
R57  80,19.7 0 top
R58  56.55,49.9 270 top
R59  61,58 0 bottom
R60  57.5,58 0 bottom
R61  58,52.5 0 bottom
R62  60.6,53 270 bottom
R63  85,33.3 0 top
R64  85,40 0 top
R65  85,35.55 0 top
R66  85,37.8 0 top
S1  3.5,35.5 90 top
S2  8.5,35.5 270 top
SJ1  69.5,41 270 top
SJ2  72,41 270 top
TP1  83,53 0 top
TP2  83,57 0 top
TP3  64,48 0 top
U$1  33.01,35.85 90 bottom
U$4  72.5,31 0 top
U$5  [C45-DIN-MOUNT-2-HOLE]  5,32.5 0 top
U$6  [C45-DIN-MOUNT-2-HOLE]  85,32.5 0 top
X1  25.5,59.5 180 top
X2  42.05,59.5 180 top

### Tracks (layer width: path | path; a pad name or v marks a point on that pad's centre or on a via)
12V_REFERENCE1
  Top 0.254: R7.2 R12.2 | R12.2 13.9,14.1 | R13.1 14.15,16.9 D2.3 13.55,16.85 14.15,16.85 R12.2
12V_REFERENCE2
  Top 0.254: R14.2 R15.2 19.15,16.9 | R16.1 19.15,16.9 | 19.15,16.9 D3.3
12V_REFERENCE3
  Top 0.254: R19.1 24.15,16.9 | R17.2 R18.2 24.15,16.9 | 24.15,16.9 D4.3
12V_REFERENCE4
  Top 0.254: R22.1 29.15,16.9 | R20.2 R21.2 29.15,16.9 | 29.15,16.9 D7.3
12V_REFERENCE5
  Top 0.254: R28.1 34.15,16.9 | R23.2 R26.2 34.15,16.9 | 34.15,16.9 D8.3
12V_REFERENCE6
  Top 0.254: R31.1 39.15,16.9 | R29.2 R30.2 39.15,16.9 | 39.15,16.9 D9.3
12V_REFERENCE7
  Top 0.254: R34.1 44.15,16.9 | R32.2 R33.2 44.15,16.9 | 44.15,16.9 D10.3
12V_REFERENCE8
  Top 0.254: R39.1 49.15,16.9 | R37.2 R38.2 49.15,16.9 | 49.15,16.9 D11.3
12V_REFERENCE9
  Top 0.254: R42.1 54.15,16.9 | R40.2 R41.2 54.15,16.9 | 54.15,16.9 D12.3
12V_REFERENCE10
  Top 0.254: R45.1 59.15,16.9 | R43.2 R44.2 59.15,16.9 | 59.15,16.9 D13.3
12V_REFERENCE11
  Top 0.254: R48.1 64.15,16.9 | R46.2 R47.2 64.15,16.9 | 64.15,16.9 D14.3
12V_REFERENCE12
  Top 0.254: R49.2 R50.2 69.15,16.9 | R51.1 69.15,16.9 | 69.15,16.9 D15.3
12V_REFERENCE13
  Top 0.254: R52.2 R53.2 74.15,16.9 | R54.1 74.15,16.9 | 74.15,16.9 D16.3
12V_REFERENCE14
  Top 0.254: R55.2 R56.2 79.15,16.9 | R57.1 79.15,16.9 | 79.15,16.9 D17.3
+3V3  (via drill 0.3, 0.4, 0.5, 0.5 pad 0.41)
  Top 0.254: R1.1 23.42,34.44 | 23.42,34.44 23.72,34.14 27.51,34.14 28.22,34.85 28.83,34.85 v28.92,34.94 | 23.42,34.44 22.5,33 22.5,26 22.3,25.8 v20.9,25.8 | 53.99,38.99 53.99,31 R27.2 | TP3.TP 62,47.5 60,46 57,43 | 57,43 55.29,41.29 C17.1 | 57,43 48.5,43 48.5,44.5 48.15,44.85 47.15,44.85 R3.2 45.99,44.99 v45.5,44.5 | 62.3,53.85 v62.35,53.8 63.6,52.55 D6.2 | v60,51 60,50.5 TP3.TP | v32.5,24.5 v32.5,30.25 | R66.2 R64.2 85.85,41.5 81.5,41.5 76.75,46.25 66.57,46.25 | 66.57,46.25 65.75,46.25 TP3.TP | R35.1 7.65,24.85 v8,24.5 | D1.2 12.1,17.85 v12.75,18.5 | D2.2 17.1,17.85 v17.75,18.5 | D3.2 22.15,17.85 v22.75,18.45 | D4.2 27.1,17.85 v27.7,18.45 | D7.2 32.2,17.85 v32.8,18.45 | D8.2 37.2,17.85 v37.8,18.45 | D9.2 42.1,17.85 v42.75,18.5 | D10.2 47.2,17.85 v47.8,18.45 | D11.2 52.15,17.85 v52.8,18.5 | D12.2 57.2,17.85 v57.85,18.5 | D13.2 62.2,17.85 v62.8,18.45 | D14.2 67.25,17.85 v67.85,18.45 | D15.2 72.25,17.85 v72.9,18.5 | D16.2 77.2,17.85 v77.85,18.5 | D17.2 82.15,17.85 v83,17 | 66.57,46.25 67,45.82 v67,43 | 4.5,61 LED1.A 3,60.55 3,53 3.5,52.5 v8,52.5
  Top 0.305: IC3.8 53.59,39.39 | 53.59,39.39 53.99,38.99 | 53.59,39.39 55.3,39.39 C17.1
  Bottom 0.254: 26.71,28.1 U$1.VDD6 | 24.33,40.35 24.32,40.34 24.12,40.34 | 23.52,41.44 23.31,41.44 | U$1.VDD2 24.12,38.85 24.12,38.84 24.13,38.85 | U$1.VDD3 | 25.07,42.54 25.07,42.64 | U$1.VDD6 | U$1.VDD1 23.32,34.85 arc83 C9.1 | 24.12,42.54 24.22,42.64 25.07,42.64 | 27.12,25.14 27.02,25.04 27,25.02 27,23.5 23,23.5 23,23.7 v20.9,25.8 | 31.92,34.94 32.5,34.94 32.5,38.8 32.35,38.85 29.31,38.85 | 31.16,34.94 31.5,34.94 31.5,30 31.65,29.85 32.75,29.85 | 32.75,29.85 38.2,29.85 | 38.2,29.85 U$1.VDD5 | 42.07,43.6 U$1.VDD4 39.01,30.66 38.2,29.85 | 42.2,43.57 42.2,42.4 45.5,42.4 v45.5,44.5 | v60,51 62.5,51 62.5,53.35 62.35,53.35 v62.35,53.8 63,54.45 63,56.5 64,57.5 64,63 56.5,63 55.8,61.8 55.8,57.35 | D18.2 55.8,57.35 | 55.8,57.35 R60.2 | 32.75,30.25 32.75,29.85 | v8,24.5 9.5,23 9.5,18 9.65,17.85 12,17.85 | v12.75,18.5 12.75,18.1 12.5,17.85 | v17.75,18.5 17.75,18.1 17.5,17.85 | v22.75,18.45 22.75,18.1 22.5,17.85 | v27.7,18.45 27.7,18.05 27.5,17.85 | v32.8,18.45 32.8,18.15 32.5,17.85 | v37.8,18.45 37.8,18.15 37.5,17.85 | v42.75,18.5 42.75,18.1 42.5,17.85 | v47.8,18.45 47.8,18.15 47.5,17.85 | v52.8,18.5 52.8,18.15 52.5,17.85 | v57.85,18.5 57.85,18.2 57.5,17.85 | v62.8,18.45 62.8,18.15 62.5,17.85 | v67.85,18.45 67.85,18.2 67.5,17.85 | v72.9,18.5 72.9,18.25 72.5,17.85 | v77.85,18.5 77.85,18.2 77.5,17.85 | v83,17 82,17 | v32.5,24.5 32.5,24 30.5,22 30.5,17.85 | v67,43 66.5,42.5 66.5,42 62.5,38 62,38 60,36 59,36 | v8,52.5 14.5,52.5 19.5,47.5 23,47.5 24.16,46.34 C1.1 arc-90 C1.1 24.15,44.85 25,44 25,42.71 25.07,42.64 | C13.1 C12.1 C12.1 arc90 21.5,41.44 22.94,41.44 arc90 23,41.5 C4.1 | C5.1 23.02,40.1 23.27,39.85 | C6.1 23,37.11 22.97,37.14
  Bottom 0.254: C10.1 26.75,28.1 U$1.VDD6
  Bottom 0.305: 53.69,33.5 53.69,31.6 C23.1 53.25,29.75 C27.1 | U$1.VDD5 41.51,29.85 41.71,29.65 41.71,28.49 C14.1 | U$1.VDDA 24.33,40.35 | 24.12,39.85 23.27,39.85 | 24.12,38.84 24.12,37.14 22.97,37.14 | U$1.VDD3 28.02,42.54 25.07,42.54 | 23.31,41.44 21.5,41.44 | 24.13,38.85 U$1.VDD2 29.31,38.85 | 24.12,38.85 24.12,39.85 | 24.12,42.54 24.12,42.04 23.52,41.44 24.12,40.84 24.12,40.34 24.12,39.85 | U$1.VDD6 27.02,25.04 | U$1.VREF+ 24.12,39.85 | U$1.VDD1 28.83,34.85 v28.92,34.94 31.16,34.94 31.92,34.94 | 59,36.7 59,36 59,30 59.6,30 F1.1 59.6,17.85 | 59.6,17.85 62.5,17.85 67.5,17.85 72.5,17.85 77.5,17.85 82,17.85 82,17 | 59.6,17.85 57.5,17.85 52.5,17.85 47.5,17.85 42.5,17.85 37.5,17.85 32.5,17.85 30.5,17.85 27.5,17.85 22.5,17.85 17.5,17.85 12.5,17.85 12,17.85 11,17.85 | 42.2,43.57 C15.1
  Bottom 0.406: 53.65,34 53.65,36.7 53.69,36.7 | 53.69,36.7 59,36.7 | 53.69,36.7 DA1.3 53.69,33.5 | v32.5,30.25 32.75,30.25
+12V
  Top 0.254: TP1.TP 74,49.5 72.5,47.96 | 72.5,47.96 72.59,47.46 72.55,47.5 | R6.1 59.5,53 61.5,53 65,49.5 70.96,49.5 F2.2 72.5,47.96
  Top 0.61: 72.55,47.5 73.55,48.5 R36.1
  Top 1.422: 72.55,47.91 F2.2 72.44,48.06
  Bottom 0.813: 69.5,11.5 GND84.2 69.5,6.5 | GND35.2 34.5,11.5 | 34.5,11.5 52,11.5 | 52,11.5 69.5,11.5 | GND31.2 17,11.5 34.5,11.5 | GND91.2 52,11.5 | GND92.2 87,11.5 | 87,11.5 69.5,11.5 | 87,11.5 88.5,13 88.5,22.5 77.5,33.5
  Bottom 1.422: U$4.IN 76.27,32.27 77.5,33.5 79,35 79,44 75.28,47.73 72.78,47.73 72.44,48.06 F2.2
A23
  Top 0.254: R58.1 56.35,50.8 R9.2 R6.2 56.15,55.15 57,56 67.1,56 D6.3
ALARM_1  (via drill 0.4)
  Top 0.254: v27.9,36.2 27.9,36.85 21.5,36.85 21.5,26.75 21.45,26.8 19.3,26.8 18,25.5 11,25.5 10.85,25.5 C49.2 R11.2
  Bottom 0.254: U$1.PC0 27.9,36.85 v27.9,36.2
ALARM_2  (via drill 0.4)
  Top 0.254: v29.4,36.85 30,35.4 30.05,24.8 16,24.8 15.9,24.8 15.85,24.8 C48.2 R13.2
  Bottom 0.254: U$1.PC1 28.6,37.35 v29.4,36.85
ALARM_3  (via drill 0.4)
  Top 0.254: v30.35,37.55 30.5,36.5 30.5,24 20.85,24 C47.2 R16.2
  Bottom 0.254: U$1.PC2 28.75,37.85 v30.35,37.55
ALARM_4  (via drill 0.4)
  Top 0.254: v31.5,37.9 31.55,23.25 26.35,23.25 C46.2 26.35,20.85 26,20.5 26,19.7 R19.2
  Bottom 0.254: U$1.PC3 31.25,38.35 v31.5,37.9
ALARM_5  (via drill 0.4)
  Top 0.254: v34,32.5 34,24.5 32.45,22.95 32.45,22.65 30.85,22.65 C45.2 R22.2
  Bottom 0.254: U$1.PA0 34,40.85 v34,32.5
ALARM_6  (via drill 0.4)
  Top 0.254: v35,34 35,24 35.85,23.15 C44.2 R28.2
  Bottom 0.254: U$1.PA1 35,41.35 v35,34
ALARM_7  (via drill 0.4)
  Top 0.254: v36,32.5 36,27 40,23 41,23 41,22 | 41,21.95 41,22 | R31.2 40.8,19.75 C43.2 41,22
  Bottom 0.254: U$1.PA2 25.26,42 36,42 v36,32.5
ALARM_8  (via drill 0.4)
  Top 0.254: v25.5,45.5 25.5,39.5 37,39.5 37,27 40,24 46,24 46,21.95 C42.2 R34.2
  Bottom 0.254: v25.5,45.5 26.99,45.5 U$1.PA3
ALARM_9  (via drill 0.4)
  Top 0.254: v27.2,47.65 26.25,44.75 26.25,40.15 37.75,40.15 37.75,27.25 40.5,24.5 50.5,24.5 51,24 51,21.95 C41.2 R39.2
  Bottom 0.254: v27.2,47.65 28.51,46.49 U$1.PA4
ALARM_10  (via drill 0.4)
  Top 0.254: v28.55,47.8 27,43.5 27,41 38.5,41 38.5,27.5 41,25 54.5,25 56,23.5 56,21.95 C40.2 R42.2
  Bottom 0.254: v28.55,47.8 28.5,47.5 29,47 29,44 29.01,43.99 U$1.PA5
ALARM_11  (via drill 0.4)
  Top 0.254: v29.8,47.7 27.8,43.8 27.8,41.85 39.25,41.85 39.25,27.75 41.5,25.5 55,25.5 57,23.5 60.5,23.5 60.85,23.15 C25.2 R45.2
  Bottom 0.254: v29.8,47.7 29.51,47.01 U$1.PA6
ALARM_12  (via drill 0.4)
  Top 0.254: v31.05,47.7 30,46.5 30,42.5 40.1,42.5 40.1,28 42.1,26 55.5,26 57.5,24 65,24 65.85,23.15 C21.2 R48.2
  Bottom 0.254: v31.05,47.7 30.01,46.51 U$1.PA7
ALARM_13  (via drill 0.4)
  Top 0.254: v32.4,47.75 30.5,46 30.5,43.5 41,43.5 41,28.5 43,26.5 56,26.5 58,24.5 70,24.5 70.85,23.65 C22.2 R51.2
  Bottom 0.254: v32.4,47.75 30.51,46.01 U$1.PC4
ALARM_14  (via drill 0.4)
  Top 0.254: v34,47.45 33.5,44.5 41.75,44.5 41.75,29 43.75,27 56.5,27 58.5,25 74.5,25 75.85,23.65 C20.2 R54.2
  Bottom 0.254: U$1.PC5 31,45.55 32.25,46.7 v34,47.45
ALARM_15  (via drill 0.4)
  Top 0.254: v35.5,46.85 35.5,46 42.5,46 42.5,29.5 44.5,27.5 57,27.5 59,25.5 75.5,25.5 75.85,25.5 78.1,25.5 80.8,22.8 80.8,21.85 C19.2 R57.2
  Bottom 0.254: v35.5,46.85 32.5,46 31.5,45 U$1.PB0
ALARM_REFERENCE  (via drill 0.4)
  Top 0.254: v40.05,47.2 43,47.2 43,46.8 52,46.8 52.5,47.5 52.5,48.4 53.15,49.05 R58.2 58.5,49.05 58.5,47.15 C18.2
  Bottom 0.254: U$1.PB1 32.01,44.66 32.35,45 33,45.5 36,46 39.85,46.6 v40.05,47.2
ASD
  Top 0.254: R8.2 R10.2 9.15,16.9 | R11.1 9.15,16.9 | 9.15,16.9 D1.3
ASDASD
  Bottom 0.254: 56.5,54.1 D18.3 56,54.5 55.5,54 58.35,54 R61.1 60.15,52.5 R62.2
BOOT0  (via drill 0.5)
  Top 0.254: v57.95,33.3 58,33.85 58,34.5 62,38.5 65,38.5 67.5,41 SJ1.2
  Bottom 0.254: U$1.BOOT0 30.01,25.65 36.35,25.65 39.1,22.9 48.45,22.9 48.5,22.95 48.5,27.5 48.8,27.8 56.5,27.8 58,29.8 58,33.3 v57.95,33.3
BOOT1  (via drill 0.5)
  Top 0.254: v46.35,47.8 48.5,50 49,50 51.5,52.5 51.5,58 67,58 69,56 v69,51 | v75.5,39 73.5,41 SJ2.2
  Bottom 0.254: U$1.PB2 32.51,44.36 32.9,44.75 34.55,45.05 40.3,45.9 41.5,47 41.6,47.1 46.3,47.1 46.35,47.25 v46.35,47.8 | v75.5,39 73.5,41 70.5,41 70.5,45 69.5,46 69.5,50.5 v69,51
BUSY_LED  (via drill 0.4)
  Top 0.254: v20.5,28 20.5,46 11.5,46
  Top 0.305: 11.5,46 9.5,48 9.5,60.5 9.45,60.55 LED2.A
  Bottom 0.254: U$1.PC13 21.35,32.85 20.5,32 v20.5,28
CAN_H
  Bottom 0.305: 55,39.88 55,41.3 55.5,41.8 55.5,44.5 | D5.2 55.25,47.6 55.15,47.7 52.7,47.55 48.35,51.9 46.5,51.9 | 46.5,51.9 30.45,51.9 | 30.45,51.9 29.95,52.41 X1.1 | X2.1 46.5,53.09 46.5,51.9 | 30.45,51.9 19.6,51.9 17,54.5 R2.2
  Bottom 0.406: DA1.7 55,39.88 | 55.5,44.5 55.25,44.75 D5.2
CAN_L
  Bottom 0.305: 53,45.18 53,42 53.69,41.31 DA1.6 | D5.1 53.35,45.85 49.95,49.25 45.23,49.25 | 45.23,49.25 X2.2 | 45.23,49.25 28.68,49.25 | 28.68,49.25 X1.2 | 28.68,49.25 19.25,49.25 15,53.5 12.5,53.5 12.23,53.77 JP2.1
  Bottom 0.406: D5.1 53,45.18
CAN_RX
  Bottom 0.254: U$1.PA11 49.05,32.35 50.7,34 DA1.4
  Bottom 0.305: 51,34 DA1.4
CAN_TX
  Bottom 0.254: U$1.PA12 49,31.85 51.35,29.15 52,28.45
  Bottom 0.305: DA1.1 56.23,28.73 55.85,28.45 52,28.45
GND  (via drill 0.3, 0.3 pad 0.3)
  Top 0.254: 28.52,33.34 v28.72,33.14 | IC3.4 49.04,44.96 48.5,45.5 | v54.47,50.64 55,51.17 55,53
  Top 0.305: IC3.1 IC3.2 IC3.3 IC3.4
  Bottom 0.254: 27.51,33.14 27.51,33.85 | U$1.PDR_ON 27.51,29.33 27.52,29.34 | 27.45,39.35 U$1.VSSA 27.85,39.35 28.5,40 32.5,40 | U$1.VSS2 27.5,46 | C4.2 22.6,44.55 C1.2 | C5.2 C13.2
  Bottom 0.305: DA1.2 54.95,31.25 | D5.3 54.3,47 | 54.3,47 54.3,47.1 | 42.24,26.77 42.72,26.77 42.72,29.14 42.01,30.35 U$1.VSS3 | U$1.VSS1 27.01,34.35 27.51,33.85 | U$1.PDR_ON 27.51,33.14 v28.72,33.14 | 27.52,29.34 26.42,29.34 25.52,28.44 24.52,27.94 23.22,27.14 | v54.22,46.79 54.22,47 54.3,47
  other vias: 28.58,31.73 28.53,34.09 32.72,33.64 32.62,32.04 12.47,36.64 12.97,40.64 12.97,43.14 12.97,33.14 12.47,30.14 17.47,47.74 12.47,50.14 16.92,53.14 11.22,55.89 2.17,63.24 80.97,62.64 76.47,40.64 85.07,15.49 76.47,37.64 50.32,37.64 51.17,34.94 46.97,40.64 45.37,46.09 36.82,47.14 56.07,56.34 31.47,4.14 27.97,4.14 23.97,4.14 2.77,15.84 57.52,38.74 54.92,35.79 19.47,43.14 62.47,37.14 68.37,47.49 25.47,47.64 18.97,44.64 21.97,46.59 70.17,55.99 58.42,50.59 14.47,63.24 10.82,62.59 2.97,3.79 8.37,8.89 85.77,4.14 84.37,13.14 67.57,14.09 77.62,13.84 64.37,37.19 86.97,15.64 66.97,37.64 72.92,23.99 81.22,44.09 88.17,42.59 81.02,49.84 79.47,54.94 66.37,56.99 65.87,63.09 80.72,57.64 64.72,57.24 38.42,47.29 60.72,35.34 67.17,50.94 87.62,25.04 87.62,62.54 84.62,62.54 87.12,59.54 84.62,60.54 86.47,27.64 84.47,29.14 86.97,30.14 82.52,38.99 84.37,31.44 79.87,45.74 81.72,36.69 83.47,23.64 81.97,24.64 80.52,24.84 52.47,14.14 84.47,25.14 72.47,14.14 84.52,9.19 87.52,4.19 83.52,4.19 86.52,13.69 83.02,13.69 81.52,4.19 77.52,4.19 73.02,4.19 69.52,4.19 64.02,4.19 60.02,4.19 56.52,4.19 53.02,4.19 50.52,4.19 48.02,4.19 44.12,4.24 40.52,4.24 36.52,4.04 48.52,9.19 67.52,9.19 5.52,3.69 15.52,4.19 20.52,4.19 33.52,4.19 8.02,4.19 4.52,9.19 12.42,14.09 2.57,28.44 10.52,4.19 13.02,4.69 8.52,39.19 5.52,30.19 5.02,39.69 30.02,4.19 2.02,42.19 10.52,53.19 1.42,48.94 9.52,46.19 7.52,48.84 6.02,48.69 5.67,50.84 1.72,57.79 2.02,61.19 5.82,63.34 17.47,56.99 1.47,52.04 6.02,55.69 12.02,47.19 86.62,55.54 86.62,51.54 81.12,47.54 83.12,9.04 3.02,25.19 14.47,48.64 57.02,45.19 51.82,41.94 59.57,44.34 52.02,60.49 53.27,60.79 23.33,30.08 23.58,26.83 27.28,30.13 27.08,32.13 19.12,54.59 20.87,48.44 23.57,48.29 20.97,54.14 33.37,50.54 35.32,50.34 31.27,50.04 36.82,53.49 25.97,58.64 43.97,59.94 26.97,63.14 21.97,63.14 23.47,60.64 10.47,61.14 37.77,62.39 42.32,62.39 46.97,63.14 45.72,57.24 49.97,56.64 18.82,51.14 43.67,57.19 39.42,57.54 33.57,53.09 35.27,53.39 28.22,57.69 52.52,62.49 51.77,59.29 12.47,20.14 5.02,16.19 17.47,20.14 22.47,20.14 27.47,20.14 32.47,20.14 37.47,20.14 42.47,20.14 47.47,20.14 52.47,20.64 57.47,20.64 67.47,20.64 72.47,20.64 77.47,20.64 57.47,14.14 62.47,14.14 47.47,14.14 42.47,14.14 37.47,14.14 32.47,14.14 17.42,13.59 22.42,13.59 27.42,13.59 62.47,21.14 57.47,22.64 4.97,14.14 4.97,12.14 2.97,13.14 60.97,28.64 60.47,31.14 52.97,23.64 58.62,28.89 58.62,27.39 57.77,28.14 22.47,57.64 59.22,54.79
  pour Top (isolate 0.305): 0,65 90,65 90,0 0,0
  pour Bottom (isolate 0.305): 0,65 90,65 90,0 0,0
HARDWARE_RESET  (via drill 0.5)
  Top 0.254: S2.4 S2.3 9.3,28.05 R35.2 v12,28
  Bottom 0.254: U$1.PE0 28.5,26 28,25.5 28,22.5 13.5,22.5 12,24.5 v12,28
I2C1_SCL  (via drill 0.4)
  Top 0.254: v46.5,29.5 48,31 48,42 | 48,42 48.5,42 | 48,42 47.01,42.99 R3.1
  Top 0.305: IC3.6 50.7,42 48.5,42
  Bottom 0.254: U$1.PB6 31.01,26.9 37.2,26.9 38.4,25.65 39,25 39.75,24.25 46.4,24.25 | 46.5,24.35 v46.5,29.5
  Bottom 0.305: 46.4,24.25 46.5,24.35
I2C1_SDA  (via drill 0.4)
  Top 0.254: v49,30 49.41,31.41 49.41,32.5 | 49.41,32.5 IC3.5 | R27.1 49.62,32.71 49.41,32.5
  Bottom 0.254: U$1.PB7 30.51,26.25 36.75,26.25 39.5,23.5 47.5,23.5 47.5,28.5 v49,30
INPUT_1
  Top 0.254: ALARMS3.1 2.82,10.75 10.85,10.75 R8.1
INPUT_2
  Top 0.254: R7.1 15.85,10 6.5,10 ALARMS3.2
INPUT_3
  Top 0.254: ALARMS3.3 10.18,9.3 17.8,9.3 17.8,10.5 20.85,10.5 R14.1
INPUT_4
  Top 0.254: ALARMS7.1 20.32,9.85 22.5,9.85 22.5,10.7 25.85,10.7 R17.1
INPUT_5
  Top 0.254: R20.1 30.85,10 24,10 ALARMS7.2
INPUT_6
  Top 0.254: R23.1 33.25,9.4 27.68,9.4 ALARMS7.3
INPUT_7
  Top 0.254: ALARMS5.1 37.82,10.5 40.85,10.5 R29.1
INPUT_8
  Top 0.254: ALARMS5.2 41.5,10 45.85,10 R32.1
INPUT_9
  Top 0.254: ALARMS5.3 45.18,9.35 47.35,9.35 47.35,10.5 50.85,10.5 R37.1
INPUT_10
  Top 0.254: ALARMS4.1 55.85,7 R40.1
INPUT_11
  Top 0.254: ALARMS4.2 59,9.5 60.85,9.5 R43.1
INPUT_12
  Top 0.254: ALARMS4.3 62.68,9.5 65.85,9.5 R46.1
INPUT_13
  Top 0.254: ALARMS6.1 72.82,10 70.85,10 R49.1
INPUT_14
  Top 0.254: ALARMS6.2 76.5,9 75.85,9 R52.1
INPUT_15
  Top 0.254: ALARMS6.3 80.18,9.5 80.85,9.5 R55.1
N$1
  Bottom 0.254: 17.06,39.99 8MHZ.2 18.72,39.99 18.72,35.85 U$1.PH1
  Bottom 0.305: C16.2 17.1,41 17,41 17,39.99 8MHZ.2
N$2
  Bottom 0.254: 16.94,30.33 8MHZ.1 18.72,30.33 18.72,35.35 U$1.PH0
  Bottom 0.305: C26.2 17.2,30.33 8MHZ.1
N$3
  Top 1.27: 65.5,27.45 63.61,27.5 U$4.OUT
  Bottom 0.813: F1.2 63.61,23.5 U$4.OUT
N$4
  Bottom 0.305: U$1.VCAP1 38.51,44.78 C2.1
N$5
  Top 0.254: R66.1 81.2,37.8 76.48,42.52 SJ2.1
N$6
  Top 0.254: R5.2 LED1.C
N$7  (via drill 0.3, 0.6)
  Top 0.254: R1.2 25.82,35.24 26.22,35.64 26.42,35.64 v26.61,35.83 27,35.44 27,35 27.4,35 27.6,35.2 27.75,35.2 27.85,35.3 28.15,35.3 28.85,36 28.85,36.1 28.9,36.15 28.25,37.2 27.95,37.5 25.5,37.5 21,42 21,46.7 14.15,46.7 13.65,47.2 v13.6,47.2 | v11.5,44.5 11.5,41 2.7,41 S1.3 S1.4
  Bottom 0.254: U$1.NRST 26.24,36.35 26.55,36.04 26.55,35.89 v26.61,35.83 | v13.6,47.2 11.5,45.1 v11.5,44.5
N$8
  Top 0.254: R4.2 LED2.C
N$9
  Bottom 0.254: U$1.VCAP2 42.48,30.85 43.79,29.42 C24.1
N$10
  Bottom 0.305: R60.1 58.35,60.15 12V2.2
N$11
  Bottom 0.254: R62.1 61.75,54.9 61.75,56
  Bottom 0.305: 12V2.1 61.85,60.15 R59.1 C11.2 61.75,56
N$12
  Bottom 0.305: R2.1 14.15,56.65 14.77,57.27 JP2.2
N$13
  Top 0.254: R64.1 80.5,40 75,45.5 70.46,45.5 69.48,44.52 69.5,44.5 SJ1.1
N$14
  Top 0.254: R65.1 75.41,35.55 72.5,38.46 72,38.46 SJ2.3
N$15
  Top 0.254: R63.1 73.66,33.3 69.5,37.46 SJ1.3
N$17
  Bottom 0.305: DA1.8 arc90 56.69,39.8 R24.1
PRE_FUSE_12V
  Top 1.422: GND8.1 77.4,56.95 73.14,53.14 F2.1 | X1.6 24.86,51.88 | X1.4 24.86,51.88 | 24.86,51.88 X1.5 | X2.6 41.41,51.88 | X2.4 41.41,51.88 | 41.41,51.88 X2.5
  Bottom 1.422: F2.1 67.64,53.14 63.5,49 54,49 47.5,55.5 41.5,55.5 | 41.5,55.5 25,55.5 24.86,55.37 X1.5 | X2.5 41.41,55.41 arc-90 41.5,55.5
SWCLK  (via drill 0.4)
  Top 0.254: PROGRAMMER.1 45.14,39.86 46.5,38.5 46.5,32.5 v45.5,30.5
  Bottom 0.254: v45.5,30.5 45.5,29.5
  Bottom 0.305: U$1.PA14 39.5,27.61 39.5,25.5 40,25 45.5,25 45.5,29.5
SWDIO  (via drill 0.4)
  Top 0.254: v43.95,30.75 44.72,31.52 PROGRAMMER.3
  Bottom 0.254: U$1.PA13 43.7,31.35 43.7,31 v43.95,30.75
TAMPER  (via drill 0.5, 0.6)
  Top 0.254: v49.35,47.65 v53.5,52
  Bottom 0.254: U$1.PB12 46.35,41.85 47,42.5 47,44.5 48.5,47 48.5,47.7 v49.35,47.65 | v53.5,52 55,51.5 57.15,51.5 R61.2
UART_RX
  Bottom 0.254: U$1.PA10 47.85,32.85 52.3,37.3 59.3,37.3 63,41 J1.1
UART_TX
  Bottom 0.254: U$1.PA9 47.35,33.35 51.95,37.95 59,37.95 61,39.95 61,43.5 61.54,44.04 J1.2

### Text on the board
_tsilk: PWR | BUSY | tamper | CAN / TERMI / NATION | GND | 12V | GND | R5 | R5 | R13 | R14 | D4 | 12V | R5 | fuse / 1A | 3.3V | C9 | D6 | R1 | UART | TX | BT0 | BT1 | AT24C | 1 | RX | R2 | SWCLK | 0 | C1 | 0 | X | R2 | GND | R2 | R2 | SWDIO | R2 | 12V | reset | R1 | factory / reset | GND | 3.3V | R2 | HW-613 | C9 / R5 / D4 / R14 / R13 | 4 | 5 | 1 | 2 | 3 | GND | 12V | 6 | GND | 12V | 7 | 8 | 9 | GND | 12V | 10 | 11 | 12 | GND | 12V | 13 | 14 | 15 | GND | 12V
_bsilk: R15 | R2 | C9 | D4 | R21 | R5 | R15 | C1 | C6 | C3 | C1 | D2 | C1 | C2 | slope / (R22) | C2 | C1 | C1 | sn65hvd230 | 8Mhz | C1 | C1 | C2 | STM32F407VET | C1 | C6 | C1 | C3 | fuse / 100/200ma
200bmp: alarm controller / 2021.03.14 / v1.7